# EAGLE design ALU (EAGLE 9.6.2)
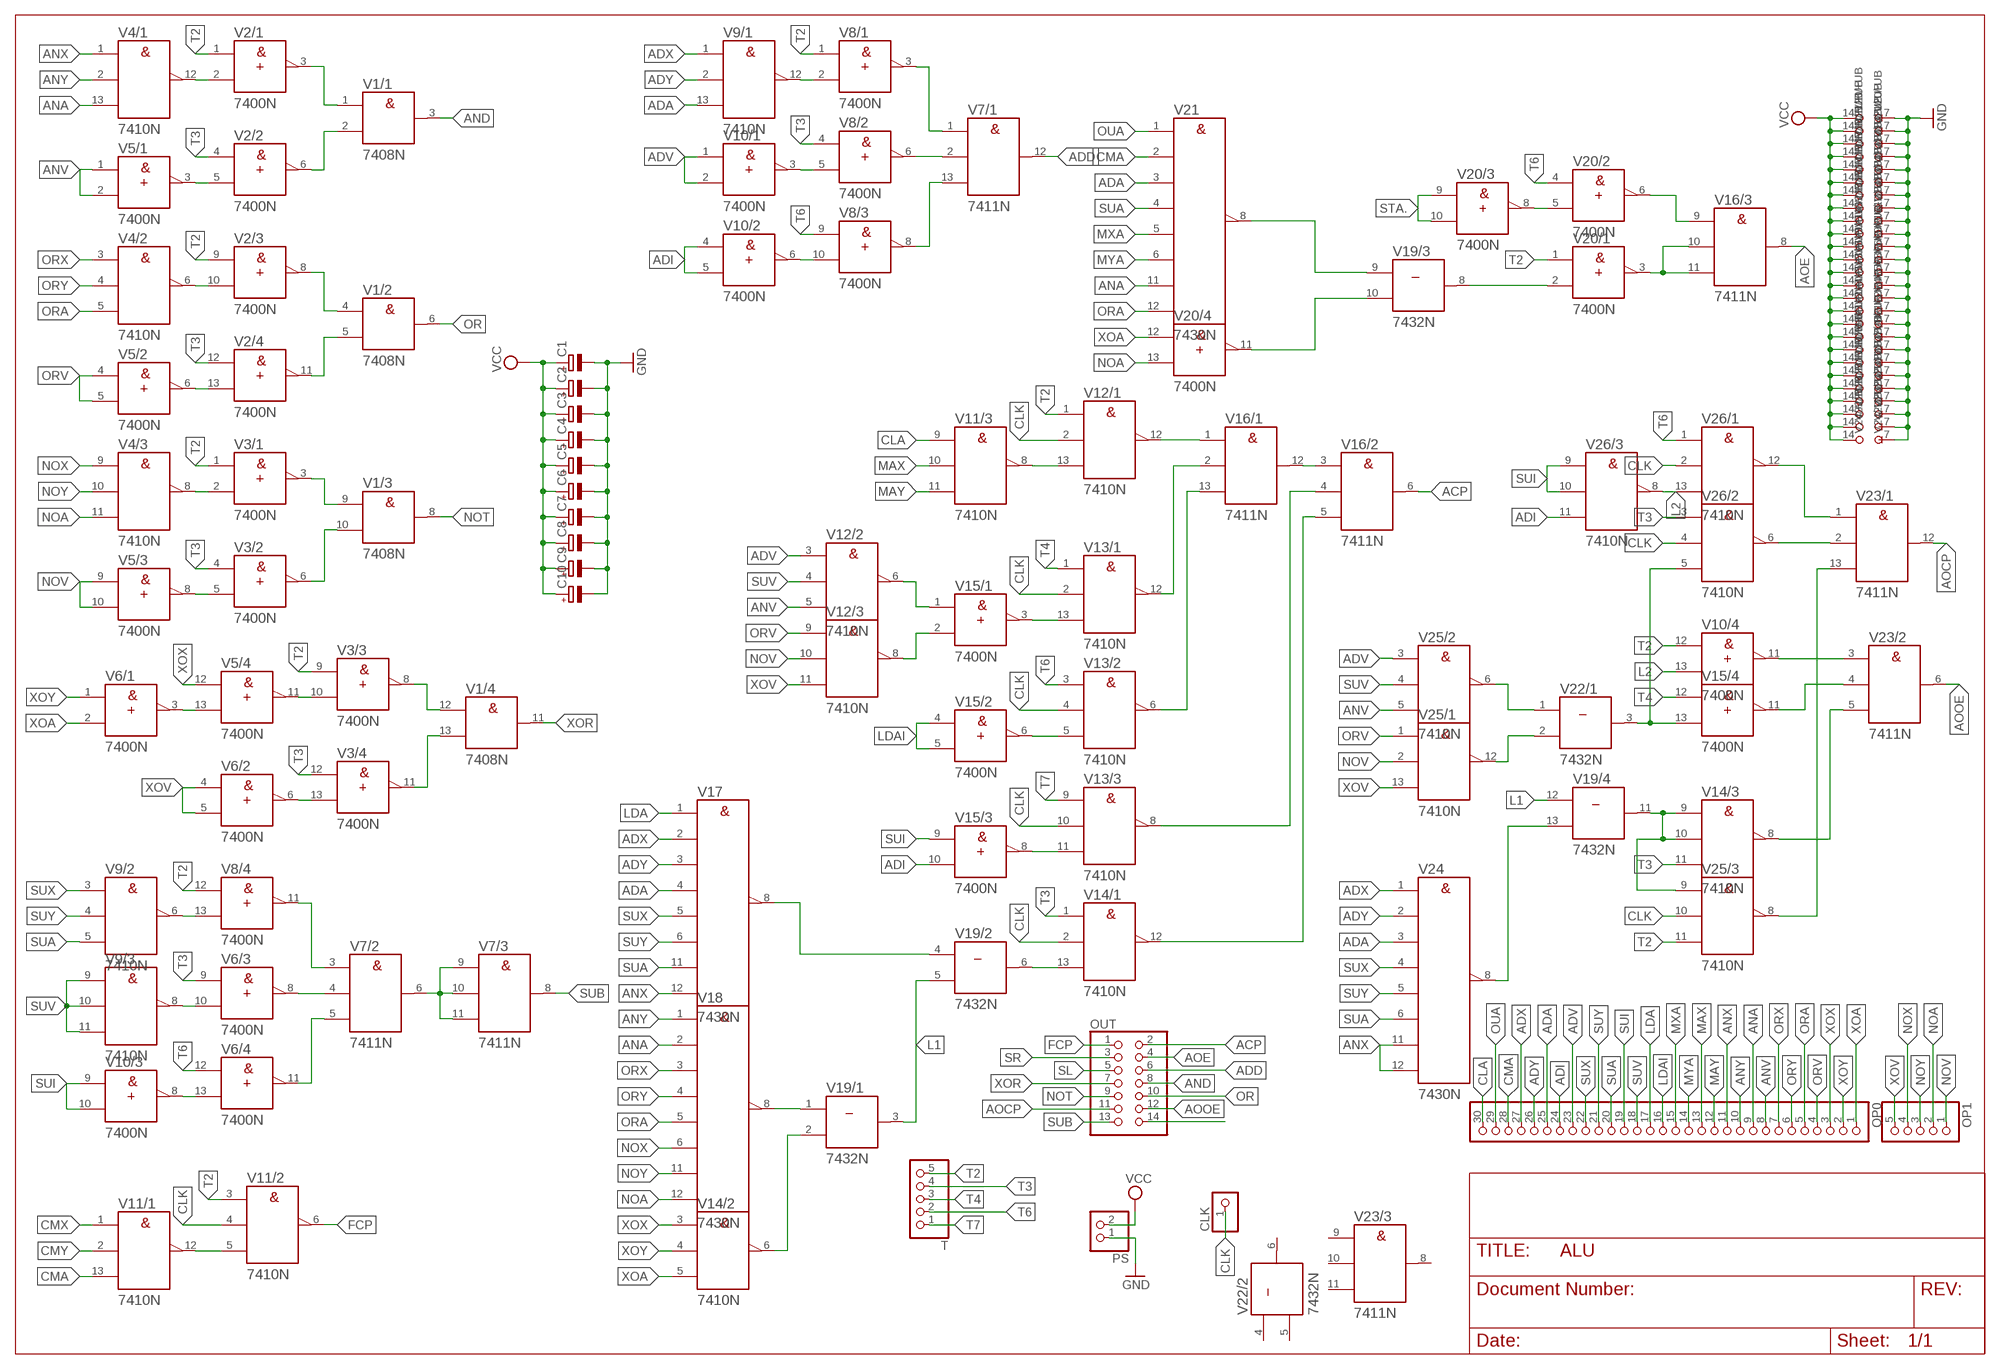
[diagram p0: schematic, sheet 1]

## Parts
C1  CPOL-EUE2.5-6  [E2,5-6]
C2  CPOL-EUE2.5-6  [E2,5-6]
C3  CPOL-EUE2.5-6  [E2,5-6]
C4  CPOL-EUE2.5-6  [E2,5-6]
C5  CPOL-EUE2.5-6  [E2,5-6]
C6  CPOL-EUE2.5-6  [E2,5-6]
C7  CPOL-EUE2.5-6  [E2,5-6]
C8  CPOL-EUE2.5-6  [E2,5-6]
C9  CPOL-EUE2.5-6  [E2,5-6]
C10  CPOL-EUE2.5-6  [E2,5-6]
CLK  PINHD-1X1  [1X01]
OP0  PINHD-1X30  [1X30]
OP1  PINHD-1X5  [1X05]
OUT  PINHD-2X7  [2X07]
PS  PINHD-1X2  [1X02]
T  PINHD-1X5  [1X05]
V1  7408N  [DIL14]
V2  7400N  [DIL14]
V3  7400N  [DIL14]
V4  7410N  [DIL14]
V5  7400N  [DIL14]
V6  7400N  [DIL14]
V7  7411N  [DIL14]
V8  7400N  [DIL14]
V9  7410N  [DIL14]
V10  7400N  [DIL14]
V11  7410N  [DIL14]
V12  7410N  [DIL14]
V13  7410N  [DIL14]
V14  7410N  [DIL14]
V15  7400N  [DIL14]
V16  7411N  [DIL14]
V17  7430N  [DIL14]
V18  7430N  [DIL14]
V19  7432N  [DIL14]
V20  7400N  [DIL14]
V21  7430N  [DIL14]
V22  7432N  [DIL14]
V23  7411N  [DIL14]
V24  7430N  [DIL14]
V25  7410N  [DIL14]
V26  7410N  [DIL14]

## Nets
ACP: OUT.2 V16.6(/2:Y)
ADA: OP0.25 V9.13(/1:C) V17.4(D) V21.3(C) V24.3(C)
ADD: OUT.6 V7.12(/1:Y)
ADI: OP0.24 V10.4(/2:A) V10.5(/2:B) V15.10(/3:B) V26.11(/3:C)
ADV: OP0.23 V10.1(/1:A) V10.2(/1:B) V12.3(/2:A) V25.3(/2:A)
ADX: OP0.27 V9.1(/1:A) V17.2(B) V24.1(A)
ADY: OP0.26 V9.2(/1:B) V17.3(C) V24.2(B)
ANA: OP0.9 V4.13(/1:C) V18.2(B) V21.11(G)
AND: OUT.8 V1.3(/1:Y)
ANV: OP0.8 V5.1(/1:A) V5.2(/1:B) V12.5(/2:C) V25.5(/2:C)
ANX: OP0.11 V4.1(/1:A) V17.12(H) V24.11(G) V24.12(H)
ANY: OP0.10 V4.2(/1:B) V18.1(A)
AOCP: OUT.11 V23.12(/1:Y)
AOE: OUT.4 V16.8(/3:Y)
AOOE: OUT.12 V23.6(/2:Y)
CLA: OP0.30 V11.9(/3:A)
CLK: CLK.1 V11.4(/2:B) V12.2(/1:B) V13.2(/1:B) V13.4(/2:B) V13.10(/3:B) V14.2(/1:B) V25.10(/3:B) V26.2(/1:B) V26.4(/2:B)
CMA: OP0.28 V11.13(/1:C) V21.2(B)
CMX: V11.1(/1:A)
CMY: V11.2(/1:B)
FCP: OUT.1 V11.6(/2:Y)
GND: C1.- C2.- C3.- C4.- C5.- C6.- C7.- C8.- C9.- C10.- PS.1 V1.7(/-UB:-UB) V2.7(/-UB:-UB) V3.7(/-UB:-UB) V4.7(/-UB:-UB) V5.7(/-UB:-UB) V6.7(/-UB:-UB) V7.7(/-UB:-UB) V8.7(/-UB:-UB) V9.7(/-UB:-UB) V10.7(/-UB:-UB) V11.7(/-UB:-UB) V12.7(/-UB:-UB) V13.7(/-UB:-UB) V14.7(/-UB:-UB) V15.7(/-UB:-UB) V16.7(/-UB:-UB) V17.7(-UB) V18.7(-UB) V19.7(/-UB:-UB) V20.7(/-UB:-UB) V21.7(-UB) V22.7(/-UB:-UB) V23.7(/-UB:-UB) V24.7(-UB) V25.7(/-UB:-UB) V26.7(/-UB:-UB)
L1: V19.3(/1:Y) V19.5(/2:B) V19.12(/4:A)
L2: V10.13(/4:B) V26.8(/3:Y) V26.13(/1:C)
LDA: OP0.17 V17.1(A)
LDAI: OP0.16 V15.4(/2:A) V15.5(/2:B)
MAX: OP0.13 V11.10(/3:B)
MAY: OP0.12 V11.11(/3:C)
MXA: OP0.15 V21.5(E)
MYA: OP0.14 V21.6(F)
N$1: V1.9(/3:A) V3.3(/1:Y)
N$2: V2.5(/2:B) V5.3(/1:Y)
N$3: V1.10(/3:B) V3.6(/2:Y)
N$4: V1.2(/1:B) V2.6(/2:Y)
N$5: V1.1(/1:A) V2.3(/1:Y)
N$6: V1.12(/4:A) V3.8(/3:Y)
N$7: V2.2(/1:B) V4.12(/1:Y)
N$8: V3.5(/2:B) V5.8(/3:Y)
N$9: V2.10(/3:B) V4.6(/2:Y)
N$10: V1.13(/4:B) V3.11(/4:Y)
N$11: V3.2(/1:B) V4.8(/3:Y)
N$12: V2.13(/4:B) V5.6(/2:Y)
N$13: OUT.14
N$14: V1.5(/2:B) V2.11(/4:Y)
N$15: V1.4(/2:A) V2.8(/3:Y)
N$16: V7.2(/1:B) V8.6(/2:Y)
N$17: V5.13(/4:B) V6.3(/1:Y)
N$18: V7.1(/1:A) V8.3(/1:Y)
N$19: V12.6(/2:Y) V15.1(/1:A)
N$20: V3.10(/3:B) V5.11(/4:Y)
N$21: V7.13(/1:C) V8.8(/3:Y)
N$22: V3.13(/4:B) V6.6(/2:Y)
N$23: V12.8(/3:Y) V15.2(/1:B)
N$24: V8.2(/1:B) V9.12(/1:Y)
N$25: V16.3(/2:A) V16.12(/1:Y)
N$26: V8.5(/2:B) V10.3(/1:Y)
N$27: V11.5(/2:C) V11.12(/1:Y)
N$28: V8.10(/3:B) V10.6(/2:Y)
N$29: V18.8(Y) V19.1(/1:A)
N$30: V8.13(/4:B) V9.6(/2:Y)
N$31: V16.10(/3:B) V16.11(/3:C) V20.3(/1:Y)
N$32: V6.10(/3:B) V9.8(/3:Y)
N$33: V14.6(/2:Y) V19.2(/1:B)
N$34: V6.13(/4:B) V10.8(/3:Y)
N$35: V6.8(/3:Y) V7.4(/2:B)
N$36: V7.3(/2:A) V8.11(/4:Y)
N$37: V6.11(/4:Y) V7.5(/2:C)
N$38: V7.6(/2:Y) V7.9(/3:A) V7.10(/3:B) V7.11(/3:C)
N$39: V17.8(Y) V19.4(/2:A)
N$40: V14.13(/1:C) V19.6(/2:Y)
N$41: V13.13(/1:C) V15.3(/1:Y)
N$42: V20.5(/2:B) V20.8(/3:Y)
N$43: V11.8(/3:Y) V12.13(/1:C)
N$44: V19.8(/3:Y) V20.2(/1:B)
N$45: V16.9(/3:A) V20.6(/2:Y)
N$46: V10.11(/4:Y) V23.3(/2:A)
N$47: V19.10(/3:B) V20.11(/4:Y)
N$48: V19.9(/3:A) V21.8(Y)
N$49: V12.12(/1:Y) V16.1(/1:A)
N$50: V13.12(/1:Y) V16.2(/1:B)
N$51: V13.6(/2:Y) V16.13(/1:C)
N$52: V13.8(/3:Y) V16.4(/2:B)
N$53: V14.12(/1:Y) V16.5(/2:C)
N$54: V15.11(/4:Y) V23.4(/2:B)
N$55: V13.5(/2:C) V15.6(/2:Y)
N$56: V13.11(/3:C) V15.8(/3:Y)
N$57: V14.8(/3:Y) V23.5(/2:C)
N$58: V23.2(/1:B) V26.6(/2:Y)
N$59: V23.1(/1:A) V26.12(/1:Y)
N$60: V14.9(/3:A) V14.10(/3:B) V19.11(/4:Y) V25.9(/3:A)
N$62: V15.13(/4:B) V22.3(/1:Y) V26.5(/2:C)
N$63: V23.13(/1:C) V25.8(/3:Y)
N$64: V19.13(/4:B) V24.8(Y)
N$69: V22.2(/1:B) V25.12(/1:Y)
N$70: V22.1(/1:A) V25.6(/2:Y)
NOA: OP1.2 V4.11(/3:C) V18.12(H) V20.13(/4:B)
NOT: OUT.9 V1.8(/3:Y)
NOV: OP1.1 V5.9(/3:A) V5.10(/3:B) V12.10(/3:B) V25.2(/1:B)
NOX: OP1.4 V4.9(/3:A) V18.6(F)
NOY: OP1.3 V4.10(/3:B) V18.11(G)
OR: OUT.10 V1.6(/2:Y)
ORA: OP0.5 V4.5(/2:C) V18.5(E) V21.12(H)
ORV: OP0.4 V5.4(/2:A) V5.5(/2:B) V12.9(/3:A) V25.1(/1:A)
ORX: OP0.7 V4.3(/2:A) V18.3(C)
ORY: OP0.6 V4.4(/2:B) V18.4(D)
OUA: OP0.29 V21.1(A)
SL: OUT.5
SR: OUT.3
STA.: V20.9(/3:A) V20.10(/3:B)
SUA: OP0.20 V9.5(/2:C) V17.11(G) V21.4(D) V24.6(F)
SUB: OUT.13 V7.8(/3:Y)
SUI: OP0.19 V10.9(/3:A) V10.10(/3:B) V15.9(/3:A) V26.9(/3:A) V26.10(/3:B)
SUV: OP0.18 V9.9(/3:A) V9.10(/3:B) V9.11(/3:C) V12.4(/2:B) V25.4(/2:B)
SUX: OP0.22 V9.3(/2:A) V17.5(E) V24.4(D)
SUY: OP0.21 V9.4(/2:B) V17.6(F) V24.5(E)
T2: T.5 V2.1(/1:A) V2.9(/3:A) V3.1(/1:A) V3.9(/3:A) V8.1(/1:A) V8.12(/4:A) V10.12(/4:A) V11.3(/2:A) V12.1(/1:A) V20.1(/1:A) V25.11(/3:C)
T3: T.4 V2.4(/2:A) V2.12(/4:A) V3.4(/2:A) V3.12(/4:A) V6.9(/3:A) V8.4(/2:A) V14.1(/1:A) V14.11(/3:C) V26.3(/2:A)
T4: T.3 V13.1(/1:A) V15.12(/4:A)
T6: T.2 V6.12(/4:A) V8.9(/3:A) V13.3(/2:A) V20.4(/2:A) V26.1(/1:A)
T7: T.1 V13.9(/3:A)
VCC: C1.+ C2.+ C3.+ C4.+ C5.+ C6.+ C7.+ C8.+ C9.+ C10.+ PS.2 V1.14(/+UB:+UB) V2.14(/+UB:+UB) V3.14(/+UB:+UB) V4.14(/+UB:+UB) V5.14(/+UB:+UB) V6.14(/+UB:+UB) V7.14(/+UB:+UB) V8.14(/+UB:+UB) V9.14(/+UB:+UB) V10.14(/+UB:+UB) V11.14(/+UB:+UB) V12.14(/+UB:+UB) V13.14(/+UB:+UB) V14.14(/+UB:+UB) V15.14(/+UB:+UB) V16.14(/+UB:+UB) V17.14(+UB) V18.14(+UB) V19.14(/+UB:+UB) V20.14(/+UB:+UB) V21.14(+UB) V22.14(/+UB:+UB) V23.14(/+UB:+UB) V24.14(+UB) V25.14(/+UB:+UB) V26.14(/+UB:+UB)
XOA: OP0.1 V6.2(/1:B) V14.5(/2:C) V20.12(/4:A)
XOR: OUT.7 V1.11(/4:Y)
XOV: OP1.5 V6.4(/2:A) V6.5(/2:B) V12.11(/3:C) V25.13(/1:C)
XOX: OP0.3 V5.12(/4:A) V14.3(/2:A)
XOY: OP0.2 V6.1(/1:A) V14.4(/2:B)
Unconnected: V22.4(/2:A) V22.5(/2:B) V22.6(/2:Y) V22.8(/3:Y) V22.9(/3:A) V22.10(/3:B) V22.11(/4:Y) V22.12(/4:A) V22.13(/4:B) V23.8(/3:Y) V23.9(/3:A) V23.10(/3:B) V23.11(/3:C)

## Library data of the parts
C1-C10 = rcl:CPOL-EU: POLARIZED CAPACITOR, European symbol; SPICEPREFIX: C
CLK = pinhead:PINHD-1X1: PIN HEADER
OP0 = pinhead:PINHD-1X30: PIN HEADER
OP1 T = pinhead:PINHD-1X5: PIN HEADER
OUT = pinhead:PINHD-2X7: PIN HEADER
PS = pinhead:PINHD-1X2: PIN HEADER
V1 = 74ttl-din:74*08: Quad 2-input AND gate
V2 V3 V5 V6 V8 V10 V15 V20 = 74ttl-din:74*00: Quad 2-input NAND gate
V4 V9 V11-V14 V25 V26 = 74ttl-din:74*10: Triple 3-input NAND gate
V7 V16 V23 = 74ttl-din:74*11: Triple 3-input AND gate
V17 V18 V21 V24 = 74ttl-din:74*30: 8-input NAND gate
V19 V22 = 74ttl-din:74*32: Quad 2-input OR gate

## Board
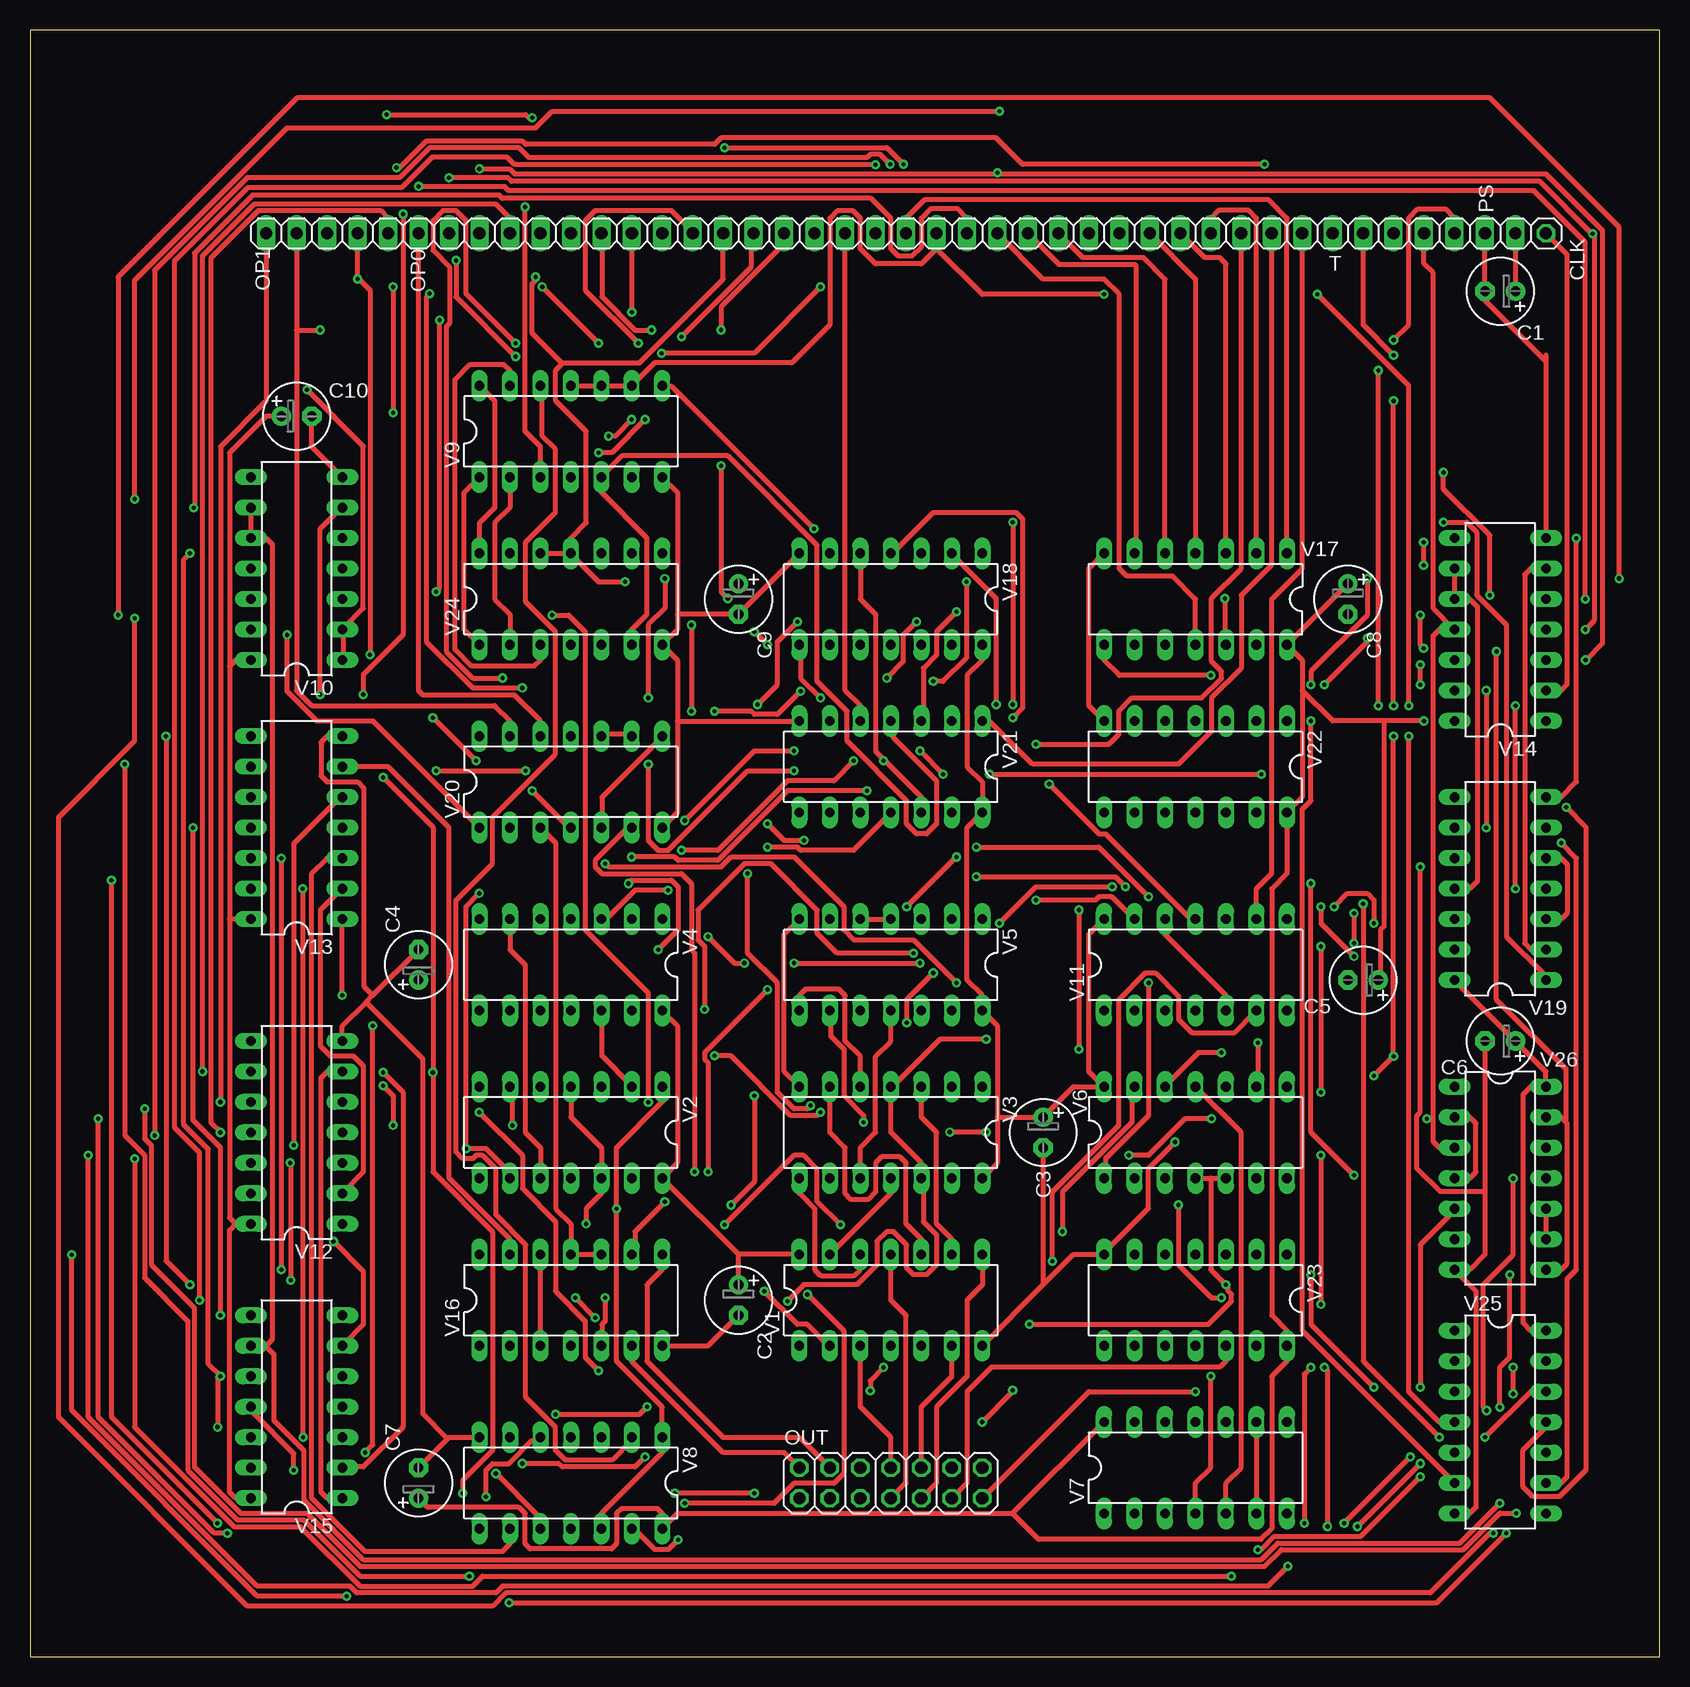
[diagram p1: board, top side]
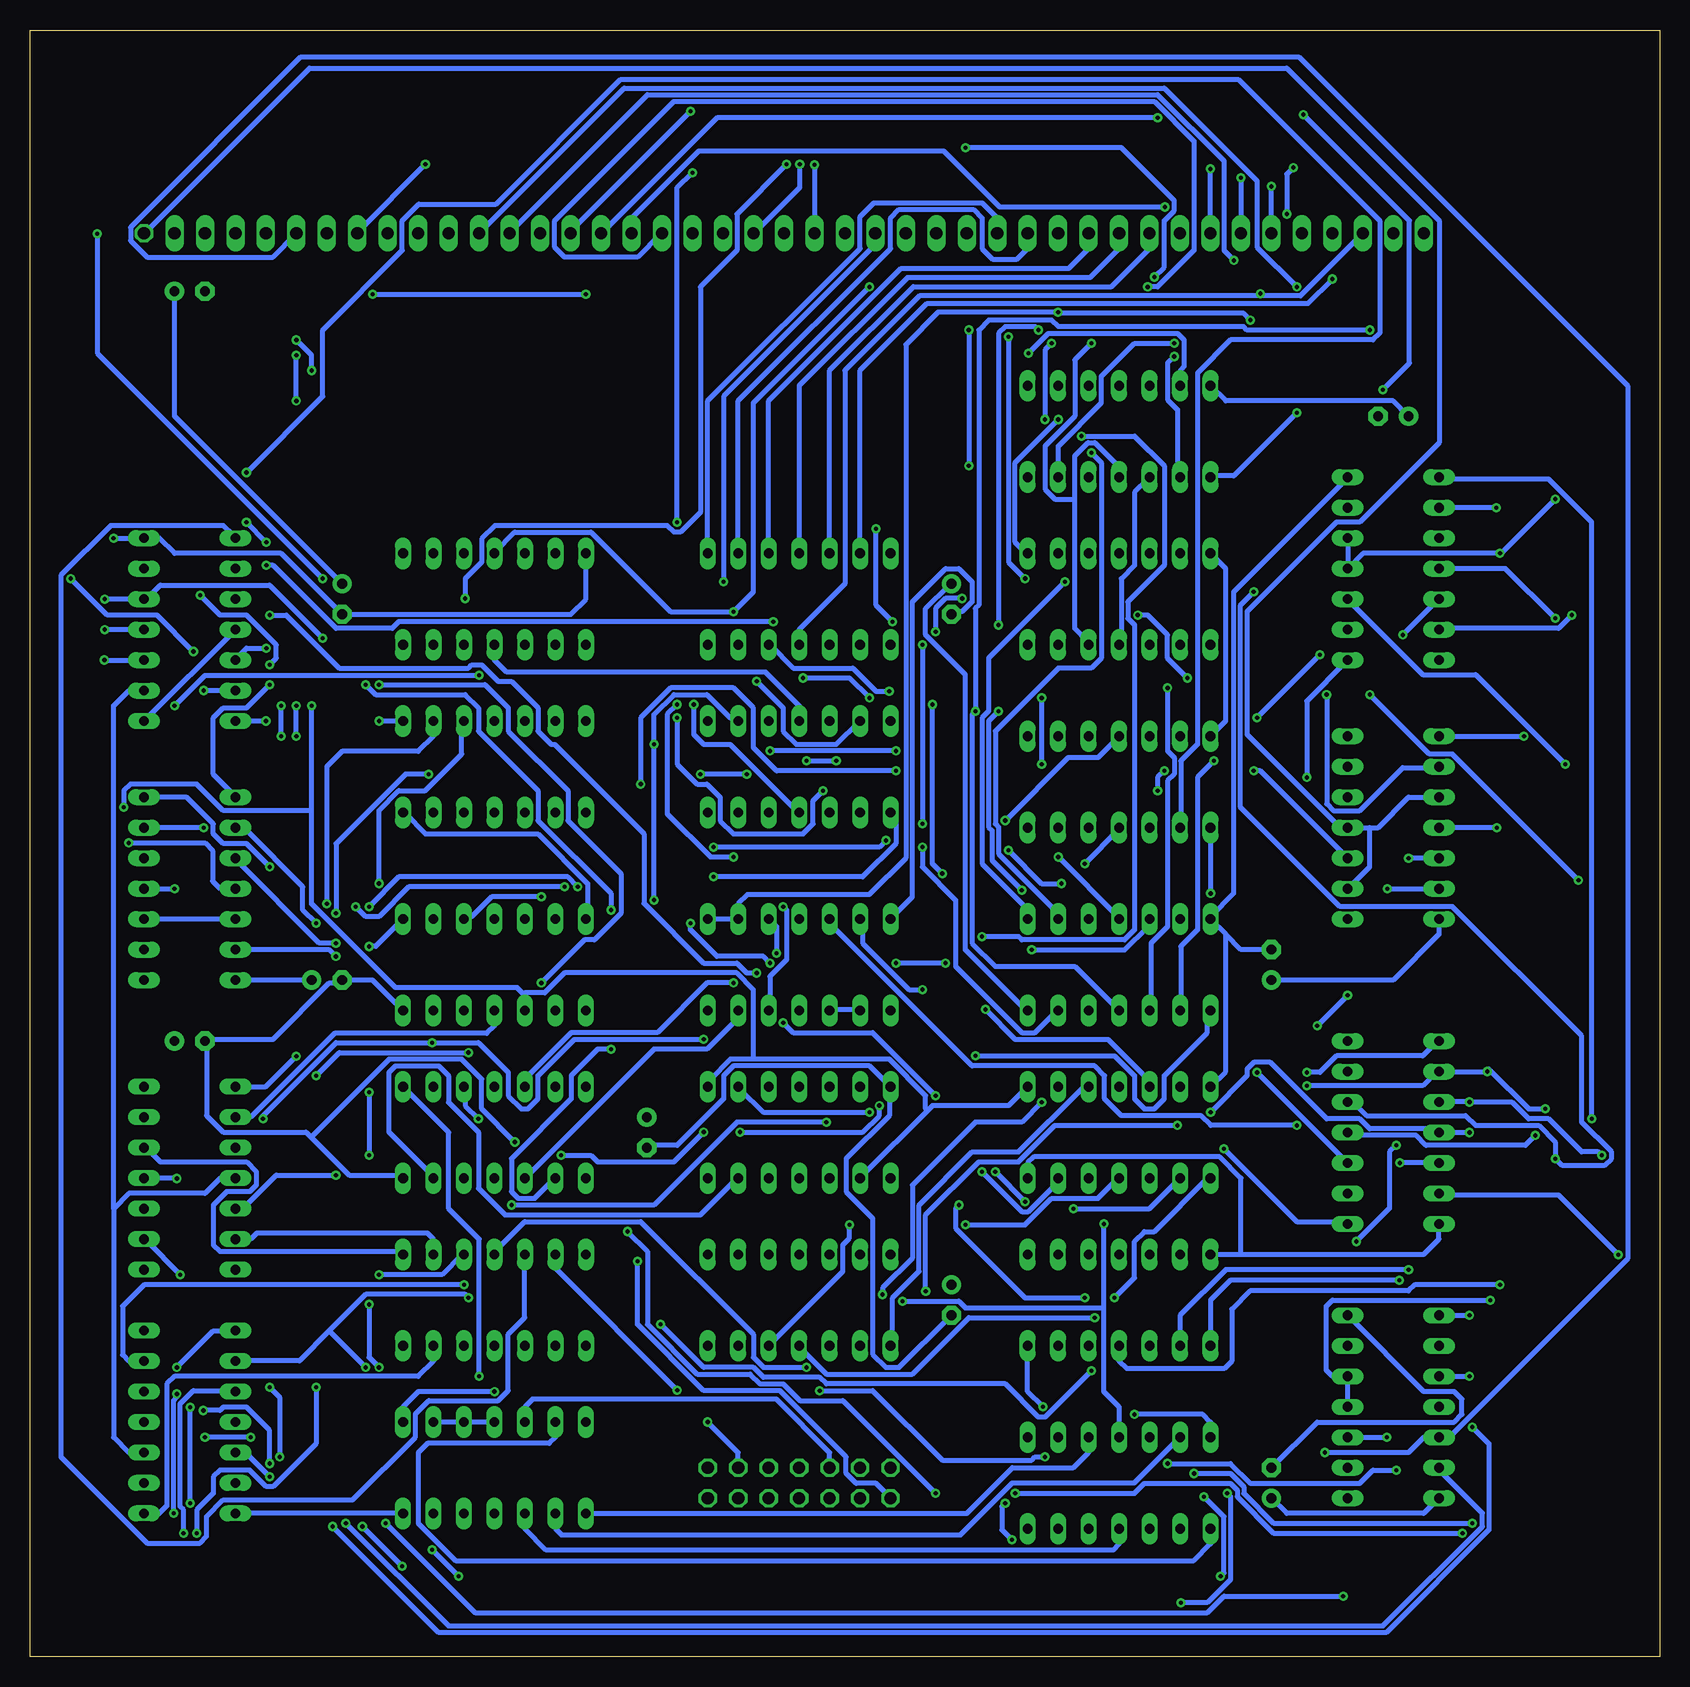
[diagram p2: board, bottom side, seen from below]

Size 135.87 x 135.56 mm. Coordinates in mm from the lower left corner, seen from the top.
Outline: 0,0 135.87,0 135.87,135.56 0,135.56 0,0
Copper layers (1*16): Top 0.035mm / dielectric 1.5mm / Bottom 0.035mm
Design rules "default *": minimum track width 0.4mm, minimum drill 0.35mm, track to track 6mil, track to pad 6mil, pad to pad 6mil, via to via 6mil, smd to smd 6mil, copper to edge 40mil, drill to drill 6mil, minimum pad ring 10mil, minimum via ring 8mil, stop-mask expansion 4mil, vias tented up to drill 0mil, thermal gap 10mil

### Footprints (pad centres in the part's own frame; a part is rotated, then mirrored left to right if it is on the bottom)
E2,5-6 = drill 0.813 pad 1.6: + -1.27,0 | drill 0.813 pad 1.6 octagon: - 1.27,0
1X01 = drill 1.016 octagon: 1 0,0
1X30 = drill 1.016 long: 1 -36.83,0; 2 -34.29,0; 3 -31.75,0; 4 -29.21,0; 5 -26.67,0; 6 -24.13,0; 7 -21.59,0; 8 -19.05,0; 9 -16.51,0; 10 -13.97,0; 11 -11.43,0; 12 -8.89,0; 13 -6.35,0; 14 -3.81,0; 15 -1.27,0; 16 1.27,0; 17 3.81,0; 18 6.35,0; 19 8.89,0; 20 11.43,0; 21 13.97,0; 22 16.51,0; 23 19.05,0; 24 21.59,0; 25 24.13,0; 26 26.67,0; 27 29.21,0; 28 31.75,0; 29 34.29,0; 30 36.83,0
1X05 = drill 1.016 long: 1 -5.08,0; 2 -2.54,0; 3 0,0; 4 2.54,0; 5 5.08,0
2X07 = drill 1.016 octagon: 1 -7.62,-1.27; 2 -7.62,1.27; 3 -5.08,-1.27; 4 -5.08,1.27; 5 -2.54,-1.27; 6 -2.54,1.27; 7 0,-1.27; 8 0,1.27; 9 2.54,-1.27; 10 2.54,1.27; 11 5.08,-1.27; 12 5.08,1.27; 13 7.62,-1.27; 14 7.62,1.27
1X02 = drill 1.016 long: 1 -1.27,0; 2 1.27,0
DIL14 = drill 0.813 long: 1 -7.62,-3.81; 2 -5.08,-3.81; 3 -2.54,-3.81; 4 0,-3.81; 5 2.54,-3.81; 6 5.08,-3.81; 7 7.62,-3.81; 8 7.62,3.81; 9 5.08,3.81; 10 2.54,3.81; 11 0,3.81; 12 -2.54,3.81; 13 -5.08,3.81; 14 -7.62,3.81

### Placement (x,y rotation side)
C1  122.56,113.79 180 top
C2  59.05,29.72 270 top
C3  84.45,43.69 270 top
C4  32.38,57.66 90 top
C5  111.12,56.39 180 top
C6  122.56,51.31 180 top
C7  32.38,14.48 90 top
C8  109.86,88.14 270 top
C9  59.05,88.14 270 top
C10  22.23,103.38 0 top
CLK  126.36,118.62 0 top
OP0  69.22,118.62 0 top
OP1  24.77,118.62 0 top
OUT  71.75,14.48 0 top
PS  122.56,118.62 0 top
T  113.67,118.62 0 top
V1  71.75,29.72 0 top
V2  45.09,43.69 180 top
V3  71.75,43.69 180 top
V4  45.09,57.66 180 top
V5  71.75,57.66 180 top
V6  97.16,43.69 0 top
V7  97.16,15.75 0 top
V8  45.09,14.48 180 top
V9  45.09,102.11 0 top
V10  22.23,90.68 90 top
V11  97.16,57.66 0 top
V12  22.23,43.69 90 top
V13  22.23,69.09 90 top
V14  122.56,85.6 90 top
V15  22.23,20.83 90 top
V16  45.09,29.72 0 top
V17  97.16,88.14 180 top
V18  71.75,88.14 180 top
V19  122.56,64.01 90 top
V20  45.09,72.9 0 top
V21  71.75,74.17 180 top
V22  97.16,74.17 180 top
V23  97.16,29.72 180 top
V24  45.09,88.14 0 top
V25  122.56,19.56 270 top
V26  122.56,39.88 270 top

### Tracks (layer width: path | path; a pad name or v marks a point on that pad's centre or on a via)
ACP
  Top 0.4: OUT.2 62.87,17.02 57.78,17.02 50.16,24.64 V16.6
ADA  (via drill 0.35)
  Top 0.4: V17.4 97.16,114.81 OP0.25 | V24.3 42.55,83.06 42.04,82.55 36.83,82.55 35.43,83.95 35.43,106.43 36.7,107.7 39.5,107.7 40.01,107.19 V9.13 | v77.22,87.08 75.57,85.42 75.57,83.49 74.46,82.39 74.46,78.24 V21.3 | v52.64,108.63 60.38,108.63 v65.9,114.15
  Bottom 0.4: V17.4 97.11,92.05 95.45,93.71 89.1,93.71 82.47,87.08 v77.22,87.08 75.57,88.74 75.57,104.48 v65.9,114.15 | v52.64,108.63 50.99,110.28 40.21,110.28 39.66,109.73 39.66,107.52 39.94,107.25 39.94,106.14 V9.13
ADD
  Bottom 0.4: OUT.6 69.22,17.02 73.66,21.46 93.98,21.46 94.61,20.83 V7.12
ADI  (via drill 0.35)
  Top 0.4: v13.34,91.95 12.83,91.44 12.83,44.32 14.86,42.29 14.86,24.38 v15.88,23.37 15.63,23.28 v15.63,19.14 | v123.63,39.85 123.63,33.5 121.14,31.01 121.14,20.8 v121.42,20.52 | v110.64,10.85 v115.89,16.1 | v80.82,128.79 43.53,128.79 42.15,127.41 21.43,127.41 8.73,114.7 v8.73,96.47
  Bottom 0.4: V15.10 v15.88,23.37 | V10.5 V10.4 24.77,91.95 v13.34,91.95 13.15,92.05 v8.73,96.47 | v123.63,39.85 126.11,39.85 V26.11 | v121.42,20.52 120.04,20.52 119.76,20.8 117.83,20.8 115.89,18.86 v115.89,16.1 | v110.64,10.85 101.81,2.01 22.81,2.01 14.25,10.57 14.25,17.76 v15.63,19.14 | v80.82,128.79 90.76,118.85 OP0.24
ADV  (via drill 0.35)
  Top 0.4: v29.44,73.27 33.59,69.13 v33.59,48.69 33.59,40.41 38.56,35.43 38.56,17.2 36.07,14.72 v36.07,13.61 | V10.1 26.13,83.22 26.13,85.42 V10.2 26.13,85.7 27.79,87.36 27.79,100.89 v23.09,105.59 | v123.07,10.3 117.27,4.5 v39.94,4.5 | v41.87,128.24 41.59,128.24 41.32,128.51 v29.72,128.51
  Bottom 0.4: v33.59,48.69 26.13,41.23 V12.3 | v29.44,73.27 29.44,79.62 26.13,82.94 V10.1 | v123.07,10.3 123.07,12.23 123.35,12.51 123.35,21.07 122.25,22.18 118.93,22.18 V25.3 | v39.94,4.5 37.73,4.5 35.8,6.43 35.8,13.34 v36.07,13.61 | v41.87,128.24 78.61,128.24 88,118.85 OP0.23 | v29.72,128.51 20.88,119.67 20.88,107.8 v23.09,105.59
ADX  (via drill 0.35)
  Top 0.4: OP0.27 98.42,119.89 99.06,120.52 101.6,120.52 102.23,119.89 V17.2 | V24.1 36.2,85.6 36.2,97.03 V9.1 | v30.27,114.15 v30.27,103.66
  Bottom 0.4: v30.27,103.66 35.52,98.41 37.45,98.41 V9.1 | v30.27,114.15 33.59,117.47 33.59,122.99 41.32,130.72 86.34,130.72 98.22,118.85 OP0.27
ADY  (via drill 0.35)
  Top 0.4: V9.2 40.01,95.76 38.73,94.49 38.73,88.14 40.01,86.87 V24.2 | OP0.26 97.92,116.59 99.19,116.59 99.69,116.08 V17.3 | v40.49,108.35 35.52,113.32 v35.52,116.36
  Bottom 0.4: v40.49,108.35 41.04,107.8 41.04,104.76 40.21,103.93 40.21,98.41 V9.2 | v35.52,116.36 36.35,117.19 36.35,124.65 41.87,130.17 84.41,130.17 95.73,118.85 OP0.26
ANA  (via drill 0.35)
  Top 0.4: v61.48,67.47 63.97,67.47 64.24,67.2 68.66,67.2 71.7,70.23 V21.11 | v80.54,79.35 80.54,88.19 76.95,91.78 V18.2
  Bottom 0.4: V18.2 76.83,104.65 64.14,117.35 64.14,119.89 63.42,120.61 57.23,120.61 56.52,119.89 56.52,117.35 55.63,116.46 53.59,116.46 52.7,117.35 OP0.9 | v61.48,67.47 61.48,65.81 58.72,63.05 58.72,57.53 53.2,52.01 52.09,52.01 50.43,53.66 V4.13 | v80.54,79.35 80.54,76.86 79.71,76.03 77.5,76.03 71.98,70.51 V21.11
AND
  Top 0.4: OUT.8 71.75,18.29 69.22,20.83 V1.3
ANV  (via drill 0.35)
  Top 0.4: OP0.8 v50.16,112.05 | v115.89,14.99 110.92,10.02 103.74,10.02 102.64,8.92 v102.36,8.92 | v100.15,6.71 37.73,6.71 36.9,5.88 27.51,5.88 22.54,10.85 17.01,10.85 8.73,19.14 v8.73,41.51 | v34.14,111.39 34.14,89.02 v33.86,88.74
  Bottom 0.4: V5.1 V5.2 76.83,62.74 76.07,63.5 65.91,63.5 62.87,66.55 62.87,109.35 60.17,112.05 v50.16,112.05 50.16,111.94 34.69,111.94 v34.14,111.39 | v115.89,14.99 117.83,16.93 118.66,16.93 V25.5 | v100.15,6.71 v102.36,8.92 | V12.5 25.85,46.48 24.47,45.1 16.18,45.1 15.36,44.27 10.11,44.27 8.73,42.89 v8.73,41.51 8.18,40.96 4.58,40.96 4.03,41.51 4.03,42.06 6.52,44.55 6.52,51.73 17.29,62.5 26.68,62.5 34.97,70.79 34.97,87.64 v33.86,88.74
ANX  (via drill 0.35)
  Top 0.4: V24.12 V24.11 | V24.11 45.09,93.22 46.35,94.49 46.35,102.11 43.81,104.65 43.81,107.19 44.45,107.82 | OP0.11 57.78,114.81 50.8,107.82 44.45,107.82 | v49.6,89.57 47.4,89.57 45.19,91.78 V24.11 | v99.6,88.19 99.6,84.6 V17.12 | v72.81,124.37 71.42,125.75 v57.89,125.75 | v42.15,114.98 42.15,114.7 41.87,114.43 41.87,110.28 44.36,107.8 44.45,107.82
  Bottom 0.4: v49.6,89.57 55.96,83.22 55.96,78.8 56.51,78.24 56.51,66.09 52.92,62.5 52.92,61.67 V4.1 | v99.6,88.19 99.6,89.84 98.22,91.23 98.22,93.16 97.11,94.26 82.75,94.26 82.2,93.71 81.64,93.71 79.99,95.37 79.99,114.15 76.95,117.19 76.95,120.23 v72.81,124.37 | v57.89,125.75 44.91,125.75 40.49,121.33 40.49,120.5 41.32,119.67 41.32,115.81 v42.15,114.98
ANY  (via drill 0.35)
  Top 0.4: v47.4,100.34 48.5,100.34 v51.26,103.1 | v50.71,109.45 46.29,113.87 46.29,119.67 47.12,120.5 53.47,120.5 55.13,118.85 OP0.10
  Bottom 0.4: OP0.10 55.24,119.89 56.52,121.16 65.53,121.16 66.67,120.02 66.67,117.35 79.38,104.65 V18.1 | v47.4,100.34 46.57,99.51 46.57,83.22 47.4,82.39 50.16,82.39 55.41,77.14 55.41,69.41 55.13,69.13 55.13,66.92 50.43,62.23 50.43,61.67 V4.2 | v51.26,103.1 51.26,108.9 v50.71,109.45
AOCP
  Top 0.4: V23.12 99.69,24.64 99.19,24.13 80.14,24.13 78.11,22.1 78.11,14.48 OUT.11
AOE
  Top 0.4: V16.8 52.7,32.26 51.44,30.99 51.44,24.64 57.78,18.29 64.14,18.29 OUT.4
AOOE  (via drill 0.35)
  Top 0.4: v79.38,19.56 81.92,22.1 v81.92,22.19
  Bottom 0.4: OUT.12 76.83,17.02 v79.38,19.56 | v81.92,22.19 92.08,32.35 V23.6
CLA
  Top 0.4: V11.9 102.23,64.01 103.5,65.28 103.5,88.14 106.05,90.68 OP0.30
CLK
  Top 0.4: V26.4 120.02,39.88 120.52,40.39 120.52,44.45 120.02,44.96 V26.2 | V14.2 127.64,80.52 128.14,81.03 128.14,116.84 CLK.1 | V12.2 26.13,38.75 27.79,40.41 27.79,49.24 26.96,50.07 25.02,50.07 24.2,50.9 24.2,62.23 25.85,63.88 V13.2
  Bottom 0.4: 24.2,69.09 V13.4 26.13,69.13 26.68,69.13 34.41,76.86 34.41,87.08 26.96,94.54 25.02,94.54 18.39,101.17 18.39,119.67 31.11,132.39 112.57,132.39 126.11,118.85 CLK.1 | 24.2,69.09 23.5,69.09 20.95,71.63 V13.10 | V25.10 127.64,17.02 128.91,18.29 128.91,37.34 | V26.4 120.02,39.88 121.28,38.61 127.64,38.61 128.91,37.34 | V14.2 127.64,80.52 128.91,79.25 128.91,37.34 | V11.4 97.16,52.58 97.79,51.94 110.49,51.94 117.47,44.96 V26.2 | 24.2,69.09 24.2,65.81 25.85,64.16 V13.2
CMA  (via drill 0.35)
  Top 0.4: v83.85,63.05 88.83,63.05 89.1,63.33 90.21,63.33 91.86,61.67 V11.13 | v83.85,76.03 89.93,76.03 90.76,76.86 90.76,78.8 91.86,79.9 97.66,79.9 99.32,81.56 99.32,82.11 98.49,82.94 98.49,88.19 100.98,90.67 100.98,118.57 OP0.28
  Bottom 0.4: v83.85,63.05 v83.85,76.03 83.85,78.52 82.2,80.18 79.44,80.18 77.5,78.24 76.95,78.24 V21.2
FCP  (via drill 0.35)
  Top 0.4: v85.23,32.95 85.23,38.75 90.76,44.27 90.76,54.77 92.97,56.98 93.8,56.98 95.73,55.04 95.73,53.11 96.83,52.01 100.43,52.01 102.08,53.66 V11.6
  Bottom 0.4: v85.23,32.95 85.23,27.7 79.71,22.18 73.36,22.18 67.83,16.65 67.83,15.27 67.01,14.44 65.35,14.44 64.24,13.34 OUT.1
GND  (via drill 0.35)
  Top 0.4: 126.36,108.46 126.36,107.95 | 126.36,107.95 V14.7 | V3.7 62.87,48.77 62.87,60.2 V5.7 | V9.7 53.98,97.03 53.98,86.87 | 53.98,86.87 53.98,85.6 V24.7 53.98,83.06 53.98,77.97 | 53.98,77.97 53.98,70.36 V20.7 | V22.7 88.27,79.25 88.27,90.68 V17.7 | V10.7 23.5,100.84 C10.- | V16.7 56.52,25.91 C2.- | V19.7 127.64,71.63 128.91,72.9 v128.91,93.22 | V12.7 26.04,52.58 28,54.55 | 28,54.55 28.57,55.12 | 28.57,55.12 C4.- | 53.98,86.87 C9.- V18.7 | V13.7 24.77,76.71 24.26,76.2 24.26,73.41 24.77,72.9 27.3,72.9 27.81,72.39 27.81,55.88 28.57,55.12 | V25.7 120.02,11.94 120.52,12.45 120.52,30.48 V26.7 120.02,32.26 121.28,33.53 121.28,38.75 | C6.- 121.28,38.75 | V1.7 84.45,30.99 | 84.45,30.99 87,33.53 V23.7 89.65,33.78 93.25,37.37 93.25,40.68 v95.45,42.89 | C3.- 84.45,30.99 | C7.- 34.82,18.18 | 34.82,18.18 34.92,18.29 V8.7 | v43.81,20.19 50.8,20.19 v51.44,20.83 | 28,54.55 32.76,49.8 32.76,20.24 34.82,18.18 | 53.98,77.97 63.97,77.97 V21.7 | v115.89,65.81 115.89,45.38 115.62,45.1 115.62,40.68 117.55,38.75 121.28,38.75 | 126.36,107.95 121.28,113.03 C1.- PS.1
  Bottom 0.4: C7.- 28.57,19.56 17.14,19.56 16.51,20.19 16.51,21.46 17.14,22.1 19.68,22.1 V15.7 | V7.7 V25.7 | C4.- 34.92,58.93 36.2,60.2 | 36.2,60.2 V4.7 37.45,61.67 35.52,63.61 35.52,88.74 26.13,98.13 V10.7 | V17.7 89.53,88.14 90.81,86.87 C8.- 114.94,91.95 123.83,91.95 125.09,93.22 V14.7 v128.91,93.22 | V2.7 36.2,48.77 36.2,60.2 | V11.7 107.31,56.39 C5.- 110.09,56.15 110.92,56.15 115.62,51.45 121.14,51.45 C6.- 121.14,51.18 121.14,45.1 119.76,43.72 112.86,43.72 112.44,43.3 | V8.7 37.47,19.56 38.1,20.19 v43.81,20.19 | v51.44,20.83 52.7,22.1 V16.7 | 112.44,43.3 109.26,40.13 104.84,40.13 V6.7 | C9.- 59,87.08 58.17,87.08 57.34,87.91 57.34,89.57 58.44,90.67 59.55,90.67 62.31,87.91 62.31,63.33 63.97,61.67 V5.7 | C3.- 84.41,42.61 81.92,42.61 78.05,46.48 78.05,48.41 77.22,49.24 65.9,49.24 64.24,47.59 V3.7 64.24,47.31 64.24,45.1 67.83,41.51 67.83,38.75 65.62,36.54 65.62,25.21 64.52,24.11 63.41,24.11 59.27,28.25 C2.- | 112.44,43.3 105.95,49.8 99.87,49.8 98.22,48.14 98.22,45.65 v95.45,42.89 | v115.89,65.81 117.83,67.75 119.76,67.75 120.59,68.58 120.59,69.41 122.8,71.61 126.11,71.61 V19.7
L1
  Top 0.4: V19.5 127.64,66.55 128.14,66.04 128.14,61.98 127.64,61.47 V19.3
  Bottom 0.4: V19.12 V19.3
L2  (via drill 0.35)
  Top 0.4: V26.8 127.64,32.26 128.14,32.77 128.14,44.45 127.91,44.69 | 127.91,44.69 127.64,44.96 V26.13 | v7.35,86.81 7.35,114.98 22.26,129.89 121.69,129.89 132.47,119.12 v132.47,89.84 | v122.25,83.77 122.25,54.77 128.05,48.97 128.05,44.82 127.91,44.69
  Bottom 0.4: v7.35,86.81 8.45,85.7 18.39,85.7 V10.13 | v132.47,89.84 129.43,86.81 125.28,86.81 v122.25,83.77
LDA
  Top 0.4: OP0.17 73.03,119.89 74.55,121.41 103.25,121.41 104.78,119.89 V17.1
LDAI  (via drill 0.35)
  Top 0.4: v14.13,29.72 14.13,42.01 12.06,44.07 12.06,116.33 18.16,122.43 30.99,122.43 33.53,124.97 39.77,124.97 40.41,124.33 v70.48,124.33
  Bottom 0.4: V15.4 V15.5 27.3,23.37 27.81,23.88 27.81,29.21 27.3,29.72 v14.13,29.72 | v70.48,124.33 OP0.16
MAX  (via drill 0.35)
  Top 0.4: v93.25,63.33 89.1,67.47 v78.88,67.47 | v64.52,68.03 62.86,68.03 v61.48,69.41 | v60.38,85.42 v61.48,84.32 | v58.17,88.19 57.62,88.74 v57.62,99.23 | v57.62,110.56 57.62,112.49 62.86,117.74 62.86,118.57 OP0.13
  Bottom 0.4: v93.25,63.33 97.39,63.33 99.05,61.67 99.6,61.67 V11.10 | v78.88,67.47 65.07,67.47 v64.52,68.03 | v61.48,84.32 v61.48,69.41 | v60.38,85.42 60.38,87.36 59.55,88.19 v58.17,88.19 | v57.62,110.56 v57.62,99.23
MAY  (via drill 0.35)
  Top 0.4: v84.96,72.72 89.1,68.58 89.65,68.58 96.56,61.67 97.11,61.67 V11.11 | v63.69,73.83 59.83,73.83 53.2,67.2 52.37,67.2 51.54,68.03 v51.54,74.38 | v51.54,79.9 51.54,85.98 52.92,87.36 v52.92,89.84 | v54.3,110.01 60.1,115.81 60.1,118.57 OP0.12
  Bottom 0.4: v84.96,72.72 84.96,78.24 82.47,80.73 77.22,80.73 75.57,79.07 75.57,75.76 73.64,73.83 v63.69,73.83 | v51.54,79.9 v51.54,74.38 | v52.92,89.84 54.3,91.23 v54.3,110.01
MXA
  Top 0.4: V21.5 69.22,79.25 67.94,80.52 OP0.15
MYA  (via drill 0.35)
  Top 0.4: v75.29,81.28 76.12,81.28 78.05,83.22 v78.05,89.57
  Bottom 0.4: v75.29,81.28 73.08,79.07 73.08,77.14 71.98,76.03 68.66,76.03 66.73,77.97 V21.6 | v78.05,89.57 78.05,105.04 65.62,117.47 65.62,118.57 OP0.14
N$1
  Top 0.4: V1.9 76.83,34.8 75.56,36.07 75.56,43.69 74.3,44.96 V3.3
N$2  (via drill 0.35)
  Top 0.4: v56.23,53.94 56.23,59.19 55.68,59.74 55.68,62.23 59.55,66.09 61.76,66.09 65.62,62.23 65.62,60.29 67.28,58.63 v73.64,58.63
  Bottom 0.4: v56.23,53.94 53.75,51.45 46.02,51.45 42.7,48.14 42.7,47.59 V2.5 | v73.64,58.63 73.64,60.84 74.19,61.4 V5.3
N$3
  Top 0.4: V1.10 74.3,34.8 73.03,36.07 73.03,41.15 72.52,41.66 70.99,41.66 70.48,41.15 70.48,38.73 69.85,38.1 68.45,38.1 67.94,38.61 67.94,42.42 66.67,43.69 V3.6
N$4  (via drill 0.35)
  Top 0.4: v40.21,44.27 40.21,47.31 V2.6 | v61.21,30.46 63.97,27.7 64.8,27.7 66.45,26.04 V1.2
  Bottom 0.4: v40.21,44.27 50.43,44.27 53.47,41.23 56.79,41.23 61.21,36.81 v61.21,30.46
N$5
  Bottom 0.4: V2.3 47.67,47.31 48.22,47.31 53.47,42.06 57.34,42.06 61.76,37.64 61.76,32.12 63.97,29.91 63.97,26.04 V1.1
N$6
  Top 0.4: V3.8 64.14,38.61 65.41,37.34 65.41,32.26 65.91,31.75 68.71,31.75 69.22,32.26 V1.12
N$7
  Top 0.4: V4.12 47.67,53.66 47.67,50.07 50.16,47.59 V2.2
N$8
  Top 0.4: V5.8 64.14,55.12 64.64,55.63 67.44,55.63 67.94,55.12 67.94,51.31 69.22,50.04 V3.5
N$9
  Top 0.4: V4.6 40.01,58.93 41.27,57.66 41.27,43.69 42.55,42.42 V2.10
N$10
  Top 0.4: V1.13 71.75,38.61 V3.11
N$11  (via drill 0.35)
  Top 0.4: v57.06,50.07 58.44,50.07 63.41,45.1 65.62,45.1 v65.9,45.38
  Bottom 0.4: v57.06,50.07 45.46,50.07 43.8,48.41 43.8,46.48 42.98,45.65 42.15,45.65 41.32,46.48 41.32,48.41 37.73,52.01 37.73,53.66 V4.8 | v65.9,45.38 74.74,45.38 76.67,47.31 V3.2
N$12  (via drill 0.35)
  Top 0.4: v56.51,40.41 56.51,49.52 56.23,49.8 56.23,50.35 v61.48,55.6
  Bottom 0.4: v56.51,40.41 53.2,37.09 52.64,37.09 50.43,39.3 50.43,39.85 V2.13 | v61.48,55.6 62.59,55.6 66.45,59.46 66.45,61.4 V5.6
N$14  (via drill 0.35)
  Top 0.4: v57.89,35.99 63.69,41.79 64.52,41.79 65.62,40.68 65.62,37.92 v67.56,35.99
  Bottom 0.4: v57.89,35.99 52.92,35.99 50.71,38.2 46.84,38.2 45.19,39.85 V2.11 | v67.56,35.99 67.56,34.88 68.11,34.33 68.11,32.12 74.19,26.04 V1.5
N$15  (via drill 0.35)
  Top 0.4: v47.12,28.25 v45.46,29.91
  Bottom 0.4: v45.46,29.91 43.8,31.57 43.8,34.6 42.98,35.43 42.15,35.43 37.73,39.85 V2.8 | v47.12,28.25 57.62,28.25 62.31,23.56 69.49,23.56 71.7,25.77 V1.4
N$16
  Bottom 0.4: V7.2 92.08,10.67 91.57,10.16 58.29,10.16 53.98,14.48 43.81,14.48 V8.6
N$17
  Bottom 0.4: V6.3 94.35,40.13 83.85,50.62 79.44,50.62 76.95,53.11 76.95,53.66 V5.13
N$18
  Bottom 0.4: V8.3 47.62,17.02 48.9,15.75 53.98,15.75 57.78,11.94 V7.1
N$19
  Top 0.4: V15.1 24.77,13.21 24.26,13.72 24.26,48.26 24.77,48.77 V12.6
N$20
  Top 0.4: V5.11 71.75,51.31 70.48,50.04 70.48,43.69 69.22,42.42 V3.10
N$21
  Bottom 0.4: V7.13 92.08,18.29 92.58,17.78 102.74,17.78 103.5,17.02 103.5,11.12 100.39,8 38.86,8 37.47,9.4 V8.8
N$22
  Bottom 0.4: V3.13 76.95,39.85 79.99,36.81 96.28,36.81 98.49,39.02 98.49,43.72 100.98,46.2 100.98,48.41 101.81,49.24 105.4,49.24 105.95,48.69 105.95,43.72 102.36,40.13 V6.6
N$23  (via drill 0.35)
  Top 0.4: v29.44,48.69 31.1,47.03 31.1,19.14 27.79,15.82 26.13,15.82 V15.2
  Bottom 0.4: v29.44,48.69 28.34,48.69 26.96,50.07 19.78,50.07 18.67,51.18 V12.8
N$24
  Top 0.4: V9.12 42.7,105.86 42.7,101.72 43.8,100.62 43.8,95.37 41.32,92.88 41.32,87.91 43.8,85.42 43.8,75.21 38.56,69.96 38.56,66.09 35.52,63.05 35.52,42.06 36.07,41.51 36.9,41.51 37.18,41.79 37.73,41.79 38.83,40.68 38.83,36.81 41.32,34.33 41.32,21.62 43.8,19.14 43.8,17.2 44.63,16.38 48.5,16.38 50.16,18.03 V8.2
N$25
  Top 0.4: V16.3 V16.12
N$26  (via drill 0.35)
  Top 0.4: v38.01,13.34 38.01,15.55 38.56,16.1 39.94,16.1 41.87,18.03 42.42,18.03 V8.5 | v36.62,6.71 27.51,6.71 22.81,11.4 17.29,11.4 13.15,15.55 13.15,27.98 9.56,31.57 9.56,41.79 7.9,43.44 v7.9,74.38
  Bottom 0.4: v38.01,13.34 36.35,11.68 36.35,6.99 v36.62,6.71 | v7.9,74.38 15.36,81.83 19.78,81.83 25.85,87.91 V10.3
N$27
  Top 0.4: V11.5 99.69,55.12 94.61,60.2 V11.12
N$28  (via drill 0.35)
  Top 0.4: v24.2,80.18 24.2,93.99 25.85,95.64 V10.6 | v6.79,64.71 6.79,19.97 v15.63,11.13 | v38.83,15.27 42.42,11.68 42.42,10.85 V8.10
  Bottom 0.4: v24.2,80.18 19.22,75.21 17.29,75.21 v6.79,64.71 | v15.63,11.13 32.2,11.13 34.69,13.61 34.69,14.17 35.8,15.27 v38.83,15.27
N$29  (via drill 0.35)
  Top 0.4: v117.83,94.54 119.76,94.54 120.59,93.71 120.59,88.46 123.07,85.98 123.07,60.02 126.11,56.98 126.11,56.42 V19.1 | v116.17,90.95 v116.17,92.88 | v73.91,86.25 72.81,85.15 72.81,82.94 v71.42,81.56 | v65.9,79.9 64.24,81.56 64.24,84.32 V18.8
  Bottom 0.4: v116.17,92.88 v117.83,94.54 | v116.17,90.95 115.62,90.95 110.37,85.7 105.67,85.7 105.12,86.25 v73.91,86.25 | v71.42,81.56 67.56,81.56 v65.9,79.9
N$30  (via drill 0.35)
  Top 0.4: v54.02,9.75 53.2,8.92 52.09,8.92 50.43,10.57 V8.13 | v54.58,12.79 62.03,12.79 63.69,14.44 67.01,14.44 67.83,15.27 67.83,27.15 v64.8,30.18 | v51.54,46.2 51.54,55.32 46.29,60.57 46.29,85.42 44.91,86.81 v43.53,86.81 | v39.39,81.56 36.9,81.56 34.69,83.77 34.69,110.84 34.97,111.11 34.97,115.81 33.59,117.19 33.59,119.67 34.41,120.5 35.52,120.5 36.35,119.67 36.35,113.6 v40.49,109.45
  Bottom 0.4: v54.02,9.75 54.85,10.57 54.85,12.51 v54.58,12.79 | v64.8,30.18 64.8,30.74 62.31,33.22 62.31,39.3 57.06,44.55 53.2,44.55 v51.54,46.2 | v43.53,86.81 42.7,86.81 41.04,85.15 41.04,83.22 v39.39,81.56 | v40.49,109.45 43.8,109.45 46.57,106.69 46.57,104.48 50.16,100.89 50.16,98.41 V9.6
N$31
  Top 0.4: V20.3 43.81,67.82 43.81,37.34 45.09,36.07 V16.11 V16.10
N$32  (via drill 0.35)
  Top 0.4: v65.35,93.99 53.47,105.86 52.92,105.86 V9.8 | v63.97,86.25 62.31,84.6 62.31,81.01 v60.65,79.35 | v59.83,65.26 59.83,58.63 62.31,56.15 62.31,47.03 63.69,45.65 64.8,45.65 v65.07,45.93 | v79.71,43.72 v76.67,43.72 | v91.59,41.79 93.25,41.79 96.28,44.82 v98.49,44.82
  Bottom 0.4: v65.35,93.99 65.35,87.64 v63.97,86.25 | v60.65,79.35 60.65,66.09 v59.83,65.26 | v65.07,45.93 65.07,45.1 66.45,43.72 v76.67,43.72 | v79.71,43.72 82.2,41.23 88.55,41.23 89.1,41.79 v91.59,41.79 | v98.49,44.82 99.6,45.93 99.6,47.31 V6.10
N$33
  Top 0.4: V14.6 125.09,90.68 124.59,90.17 124.59,59.44 125.09,58.93 V19.2
N$34  (via drill 0.35)
  Top 0.4: v5.69,44.82 5.69,19.97 15.36,10.3 v16.46,10.3 | v60.38,13.61 v53.75,13.61 | v86.06,35.43 86.06,38.75 91.86,44.55 91.86,47.31 V6.13
  Bottom 0.4: v5.69,44.82 5.69,94.54 9.28,98.13 18.39,98.13 V10.8 | v16.46,10.3 32.2,10.3 35.24,13.34 35.24,13.89 35.8,14.44 42.98,14.44 43.8,13.61 v53.75,13.61 | v60.38,13.61 68.11,21.35 71.7,21.35 73.08,22.73 75.02,22.73 75.84,23.56 80.26,23.56 84.41,27.7 84.41,33.78 v86.06,35.43
N$35  (via drill 0.35)
  Top 0.4: V7.4 97.16,14.48 98.42,15.75 v98.42,23.37
  Bottom 0.4: v98.42,23.37 98.42,34.8 100.97,37.34 100.97,43.69 V6.8
N$36
  Bottom 0.4: V8.11 45.09,9.4 45.59,8.89 92.84,8.89 94.61,10.67 V7.3
N$37
  Top 0.4: V7.5 99.69,14.48 100.97,15.75 100.97,43.69 V6.11
N$38
  Top 0.4: V7.9 V7.6
  Bottom 0.4: V7.11 V7.10 V7.9
N$39  (via drill 0.35)
  Top 0.4: v123.83,64.01 v123.83,79.25 | v98.42,81.79 90.81,81.79 89.53,83.06 V17.8
  Bottom 0.4: V19.4 v123.83,64.01 | v123.83,79.25 121.28,81.79 v98.42,81.79
N$40  (via drill 0.35)
  Top 0.4: v121.38,80.52 v121.38,69.09
  Bottom 0.4: V14.13 v121.38,80.52 | v121.38,69.09 V19.6
N$41  (via drill 0.35)
  Top 0.4: v22.76,18.29 22.76,63.98 v22.73,64.01
  Bottom 0.4: V15.3 v22.76,18.29 | v22.73,64.01 V13.13
N$42
  Top 0.4: V20.5 47.67,69.13 47.67,71.61 52.64,76.59 V20.8
N$43  (via drill 0.35)
  Top 0.4: v3.48,33.5 3.48,20.52 18.95,5.05 v26.4,5.05 | v106.23,11.13 106.23,23.56 v106.78,24.11 | v107.61,41.79 v107.61,29.36 | v107.61,59.19 v107.61,47.03
  Bottom 0.4: v3.48,33.5 8.45,38.47 18.39,38.47 V12.13 | v26.4,5.05 36.35,5.05 37.73,3.67 98.77,3.67 v106.23,11.13 | v106.78,24.11 107.61,24.94 v107.61,29.36 | v107.61,47.03 v107.61,41.79 | v107.61,59.19 107.06,59.19 104.84,61.4 V11.8
N$44  (via drill 0.35)
  Top 0.4: v117.83,98.68 117.83,97.3 121.69,93.44 v121.69,88.46 | v115.89,81.01 v115.89,82.66
  Bottom 0.4: v117.83,98.68 111.47,105.04 111.47,110.56 104.84,117.19 104.84,119.67 103.46,121.06 97.03,121.06 86.63,131.45 35.14,131.45 23.37,119.67 23.37,110.28 23.92,109.73 35.8,109.73 38.56,106.97 38.56,76.03 39.94,74.65 39.94,69.13 V20.2 | v121.69,88.46 120.04,86.81 117.83,86.81 115.34,84.32 115.34,83.22 v115.89,82.66 | v115.89,81.01 117.83,79.07 119.76,79.07 120.59,78.24 120.59,73.55 118.93,71.89 V19.8
N$45  (via drill 0.35)
  Top 0.4: v52.92,37.92 50.43,35.43 50.43,33.78 V16.9 | v55.41,40.41 55.41,58.63 55.13,58.91 55.13,64.43 54.3,65.26 47.67,65.26 47.12,65.81 47.12,66.37 49.6,68.85 50.16,68.85 V20.6
  Bottom 0.4: v55.41,40.41 v52.92,37.92
N$46  (via drill 0.35)
  Top 0.4: v8.73,86.53 8.73,76.31 2.38,69.96 2.38,19.97 18.12,4.22 38.56,4.22 39.66,5.33 116.72,5.33 121.69,10.3 v121.97,10.3 | v112.03,22.45 106.78,27.7 v106.78,31.84
  Bottom 0.4: v8.73,86.53 12.87,90.67 18.39,90.67 V10.11 | v121.97,10.3 121.97,12.23 120.59,13.61 120.59,14.99 120.04,15.55 117.55,15.55 116.17,14.17 115.62,14.17 112.03,17.76 v112.03,22.45 | v106.78,31.84 101.53,31.84 99.87,33.5 V23.3
N$47  (via drill 0.35)
  Top 0.4: v110.37,61.95 v110.37,59.46 | v79.99,73.55 v102.64,73.55 | v74.19,75.48 v76.12,73.55 | v63.69,75.48 60.38,75.48 v54.58,69.68
  Bottom 0.4: v110.37,59.46 111.75,59.46 118.66,66.37 V19.10 | v110.37,61.95 110.37,67.75 104.57,73.55 v102.64,73.55 | v76.12,73.55 v79.99,73.55 | v63.69,75.48 v74.19,75.48 | v54.58,69.68 49.33,74.93 46.84,74.93 45.19,76.59 V20.11
N$48  (via drill 0.35)
  Top 0.4: v112.03,61.12 112.03,63.05 111.47,63.61 109.82,63.61 v108.71,62.5 | v91.31,64.16 90.48,64.99 v78.88,64.99
  Bottom 0.4: v112.03,61.12 113.13,62.23 113.13,64.16 117.83,68.85 118.66,68.85 V19.9 | v108.71,62.5 107.88,61.67 106.78,61.67 104.29,64.16 v91.31,64.16 | v78.88,64.99 66.45,64.99 63.69,67.75 63.69,69.96 63.97,70.23 V21.8
N$49  (via drill 0.35)
  Top 0.4: v21.69,41.15 21.72,41.12 v21.72,31.37
  Bottom 0.4: V12.12 v21.69,41.15 | v21.72,31.37 35.81,31.37 37.47,29.72 V16.1
N$50  (via drill 0.35)
  Top 0.4: v20.95,66.55 v20.95,32.26
  Bottom 0.4: V13.12 v20.95,66.55 | v20.95,32.26 36.2,32.26 40.01,28.45 V16.2
N$51
  Top 0.4: V16.13 40.01,34.8 34.92,39.88 34.92,69.09 29.84,74.17 V13.6
N$52  (via drill 0.35)
  Top 0.4: v11.33,76.71 11.33,32.99 v13.34,30.99
  Bottom 0.4: V16.4 45.09,24.64 44.45,24 36.32,24 35.69,24.64 35.69,28.96 34.16,30.48 20.95,30.48 20.45,30.99 v13.34,30.99 | V13.8 v11.33,76.71
N$53  (via drill 0.35)
  Top 0.4: v47.95,29.91 47.95,27.98 47.67,27.7 47.67,26.04 V16.5 | v58.44,37.64 60.38,39.58 v60.38,46.76 | v73.08,52.83 73.08,54.77 v75.29,56.98 | v115.89,86.81 115.89,84.32 v116.17,84.04
  Bottom 0.4: v47.95,29.91 52.92,29.91 58.72,35.71 58.72,37.37 v58.44,37.64 | v60.38,46.76 65.62,52.01 72.25,52.01 v73.08,52.83 | v75.29,56.98 76.12,56.98 76.95,57.8 79.71,57.8 84.68,62.78 84.68,68.58 92.14,76.03 92.42,76.03 93.52,77.14 93.52,79.07 95.73,81.28 96.83,81.28 98.22,82.66 99.05,82.66 99.32,82.39 110.09,82.39 114.51,86.81 v115.89,86.81 | v116.17,84.04 117.83,84.04 118.66,83.22 V14.12
N$54  (via drill 0.35)
  Top 0.4: v21.98,15.55 21.98,16.93 18.67,20.24 18.67,20.8 V15.11 | v41.04,16.1 44.08,16.1 44.36,15.82 50.43,15.82 v51.26,16.65 | v70.04,22.18 70.04,23 v71.15,24.11
  Bottom 0.4: v21.98,15.55 23.92,15.55 25.02,14.44 34.14,14.44 35.8,16.1 v41.04,16.1 | v51.26,16.65 52.09,16.65 52.37,16.38 59.83,16.38 65.62,22.18 v70.04,22.18 | v71.15,24.11 74.74,24.11 75.57,24.94 75.57,26.87 84.96,36.26 94.63,36.26 97.11,33.78 V23.4
N$55  (via drill 0.35)
  Top 0.4: v25.3,34.6 27.79,32.12 27.79,27.7 26.13,26.04 V15.6 | v21.98,42.61 21.98,67.75 25.85,71.61 V13.5
  Bottom 0.4: v25.3,34.6 22.54,37.37 22.54,42.06 v21.98,42.61
N$56  (via drill 0.35)
  Top 0.4: v15.88,28.45 15.88,42.42 13.59,44.7 v13.59,69.09
  Bottom 0.4: V15.8 v15.88,28.45 | v13.59,69.09 V13.11
N$57
  Bottom 0.4: V23.5 94.63,33.5 94.63,28.25 96.01,26.87 96.01,22.18 96.83,21.35 102.64,21.35 103.74,20.24 103.74,18.31 108.99,13.06 119.76,13.06 121.14,11.68 121.14,10.02 121.69,9.47 126.11,9.47 133.29,16.65 133.29,90.12 129.15,94.26 119.76,94.26 118.93,93.44 V14.8
N$58
  Bottom 0.4: V23.2 102.23,34.8 102.74,35.31 116.97,35.31 117.47,34.8 V26.6
N$59
  Bottom 0.4: V23.1 104.84,33.78 120.04,33.78 120.59,34.33 120.59,37.64 119.48,38.75 117.55,38.75 117,39.3 117,40.41 117.83,41.23 125.01,41.23 126.11,42.34 V26.12
N$60  (via drill 0.35)
  Top 0.4: V14.9 V14.10 120.02,88.14 120.65,87.5 120.65,64.64 120.02,64.01 V19.11 | V25.9 127.64,14.48 128.14,14.99 128.14,31.5 128.91,32.26 128.91,66.55 v127.64,67.82
  Bottom 0.4: v127.64,67.82 121.28,67.82 120.65,67.18 120.65,64.64 120.02,64.01 V19.11
N$62  (via drill 0.35)
  Top 0.4: v115.06,16.65 v109.54,11.13 | v115.89,22.45 115.89,34.33 118.66,37.09 V26.5 | v106.78,64.43 106.78,43.72 v110.37,40.13
  Bottom 0.4: v109.54,11.13 100.98,2.56 23.09,2.56 14.8,10.85 14.8,11.96 18.39,15.55 V15.13 | v115.06,16.65 115.06,21.62 v115.89,22.45 | v106.78,64.43 106.78,70.51 105.12,72.17 102.91,72.17 99.87,75.21 99.87,77.97 V22.3 | v110.37,40.13 115.34,40.13 118.1,37.37 118.66,37.37 V26.5
N$63
  Bottom 0.4: V23.13 102.23,24.64 103.5,23.37 123.83,23.37 124.46,22.73 124.46,12.57 125.09,11.94 V25.8
N$64  (via drill 0.35)
  Top 0.4: v110.37,58.36 107.61,61.12 v107.61,62.5 | v90.21,64.16 83.85,64.16 v80.82,61.12 | v63.69,57.8 v74.19,57.8 | v59.55,57.8 58.72,57.8 v56.51,60.02 | v48.22,101.72 48.78,101.72 v50.16,103.1
  Bottom 0.4: v110.37,58.36 110.92,58.91 118.66,58.91 V19.13 | v107.61,62.5 105.12,64.99 91.03,64.99 v90.21,64.16 | v80.82,61.12 80.82,60.57 78.61,58.36 74.74,58.36 v74.19,57.8 | v59.55,57.8 v63.69,57.8 | v56.51,60.02 53.47,60.02 53.2,59.74 44.63,59.74 43.8,60.57 43.8,85.98 44.36,86.53 44.36,87.91 41.32,90.95 41.32,99.23 43.8,101.72 v48.22,101.72 | v50.16,103.1 53.75,99.51 53.75,92.88 52.92,92.05 V24.8
N$69  (via drill 0.35)
  Top 0.4: v121.28,18.29 125.09,22.1 V25.12 | v111.12,62.74 111.12,24.64 v117.47,18.29
  Bottom 0.4: V22.2 102.23,76.71 103.5,75.44 109.86,75.44 111.12,74.17 v111.12,62.74 | v117.47,18.29 v121.28,18.29
N$70  (via drill 0.35)
  Top 0.4: V25.6 106.05,27.18 106.05,70.61 106.78,71.34 v106.78,77.98
  Bottom 0.4: v106.78,77.98 V22.1
NOA  (via drill 0.35)
  Top 0.4: V20.13 40.01,77.98 38.73,79.25 23.5,79.25 22.23,80.52 22.23,110.56 | OP1.2 22.23,110.56 | v57.06,78.8 60.1,78.8 60.38,78.52 62.31,78.52 v64.24,80.45 | 22.23,110.56 v24.2,110.56
  Bottom 0.4: v64.24,80.45 65.35,80.45 67.28,82.39 72.25,82.39 74.19,84.32 V18.12 | V4.11 45.19,53.94 48.78,57.53 55.41,57.53 57.34,59.46 57.34,78.52 v57.06,78.8 57.06,87.36 56.79,87.64 56.79,110.56 55.96,111.39 50.71,111.39 50.16,110.84 34.69,110.84 34.41,110.56 v24.2,110.56
NOT
  Top 0.4: OUT.9 75.56,14.48 75.56,20.83 78.11,23.37 78.11,29.72 79.38,30.99 V1.8
NOV  (via drill 0.35)
  Top 0.4: OP1.1 19.68,104.65 15.88,100.84 v15.88,46.23 | v99.32,29.91 98.49,29.91 95.73,32.67 v95.73,37.64 | v69.49,44.55 69.49,45.1 67.83,46.76 67.83,50.62 66.73,51.73 66.73,53.66 V5.9 | v4.86,41.79 4.86,19.97 18.95,5.88 26.68,5.88 27.23,5.33 38.83,5.33 39.39,5.88 103.19,5.88 v104.84,7.54 | v108.16,10.85 108.16,23.83 v107.88,24.11
  Bottom 0.4: V12.10 v15.88,46.23 15.63,46.2 12.32,46.2 10.94,44.82 9.28,44.82 6.52,42.06 5.14,42.06 v4.86,41.79 | V5.9 66.73,53.94 68.94,53.94 V5.10 | 110.92,27.15 107.88,30.18 99.6,30.18 v99.32,29.91 | 110.92,27.15 113.41,24.66 118.66,24.66 V25.2 | v95.73,37.64 83.85,37.64 76.95,44.55 v69.49,44.55 | v108.16,10.85 v104.84,7.54 | 110.92,27.15 v107.88,24.11
NOX  (via drill 0.35)
  Top 0.4: OP1.4 v27.3,114.81 27.51,114.7 28.34,113.87 v28.34,83.49 | v33.59,78.24 v37.18,74.65
  Bottom 0.4: V18.6 66.67,107.19 61.09,112.78 29.34,112.78 v27.3,114.81 | v37.18,74.65 38.56,73.27 38.56,60.57 39.94,59.19 39.94,53.94 V4.9 | v28.34,83.49 v33.59,78.24
NOY  (via drill 0.35)
  Top 0.4: v41.04,80.73 36.9,80.73 33.03,84.6 33.03,113.32 v33.31,113.6
  Bottom 0.4: OP1.3 29.97,113.41 33.31,113.41 | V18.11 71.75,85.6 67.94,89.41 67.94,107.19 61.72,113.41 33.31,113.41 | v41.04,80.73 41.04,75.48 40.49,74.93 40.49,73.55 41.04,73 41.04,60.84 42.42,59.46 42.42,53.94 V4.10 | v33.31,113.6 33.31,113.41
OR
  Top 0.4: OUT.10 74.3,20.83 76.83,23.37 V1.6
ORA  (via drill 0.35)
  Top 0.4: V18.5 69.22,88.14 70.48,86.87 70.48,75.44 71.21,74.71 | V21.12 74.3,71.63 71.21,74.71 | v52.37,58.91 54.02,60.57 54.02,64.16 53.47,64.71 50.16,64.71 v49.88,64.43 | v54.3,67.2 57.34,67.2 63.14,73 67.01,73 v68.66,74.65 | v71.15,74.65 71.21,74.71
  Bottom 0.4: V18.5 69.22,107.19 62.23,114.17 45.72,114.17 42.55,117.35 OP0.5 | v52.37,58.91 44.63,58.91 42.7,60.84 42.7,61.4 V4.5 | v49.88,64.43 51.54,64.43 v54.3,67.2 | v71.15,74.65 v68.66,74.65
ORV  (via drill 0.35)
  Top 0.4: v14.38,48.77 14.38,116.74 18.71,121.08 38.82,121.08 40.01,119.89 OP0.4 | V5.5 69.22,61.4 71.7,61.4 V5.4 | v123.63,21.9 v123.63,24.11 | v123.9,11.96 122.52,11.96 119.48,8.92 104.29,8.92 102.91,7.54 27.51,7.54 23.09,11.96 17.57,11.96 13.7,15.82 13.7,29.08 10.11,32.67 10.11,42.61 9.56,43.17 v9.56,45.65 | v30.27,44.27 30.27,46.76 v29.44,47.59
  Bottom 0.4: v123.63,24.11 120.59,27.15 118.93,27.15 V25.1 | v123.63,21.9 123.63,21.62 123.9,21.35 v123.9,11.96 | v9.56,45.65 10.94,45.65 14.25,48.97 v14.38,48.77 V12.9 18.67,48.69 19.78,47.59 v29.44,47.59 | v30.27,44.27 37.45,44.27 38.28,45.1 44.91,45.1 46.29,46.48 46.29,48.41 47.12,49.24 57.34,49.24 68.94,60.84 68.94,61.4 V5.5
ORX  (via drill 0.35)
  Top 0.4: v53.2,63.88 50.43,63.88 48.22,61.67 47.67,61.67 V4.3 | v55.13,85.98 v55.13,78.8 | v51.81,110.56 50.43,110.56 47.67,113.32 47.67,118.57 OP0.7
  Bottom 0.4: V18.3 74.3,104.65 63.25,115.7 49.28,115.7 47.62,117.35 OP0.7 | v53.2,63.88 55.68,66.37 55.68,68.85 55.96,69.13 55.96,77.97 v55.13,78.8 | v55.13,85.98 55.13,110.28 54.58,110.84 52.09,110.84 v51.81,110.56
ORY  (via drill 0.35)
  Top 0.4: v50.16,66.64 53.75,66.64 54.02,66.37 57.34,66.37 63.14,72.17 v69.77,72.17 | v81.92,78.24 82.75,79.07 82.75,94.82 82.2,95.37 75.29,95.37 71.98,92.05 V18.4
  Bottom 0.4: OP0.6 45.09,117.35 47.5,114.94 62.74,114.94 71.75,105.92 V18.4 | v50.16,66.64 45.19,61.67 V4.4 | v69.77,72.17 70.6,71.34 70.6,69.41 71.42,68.58 77.22,68.58 78.33,69.68 78.33,71.61 79.44,72.72 80.26,72.72 81.92,74.38 v81.92,78.24
OUA
  Top 0.4: V21.1 79.44,77.97 79.99,77.97 83.58,74.38 95.73,74.38 98.49,77.14 98.49,79.9 100.98,82.39 100.98,88.46 103.46,90.95 103.46,118.57 OP0.29
STA.
  Top 0.4: V20.10 47.67,76.86 50.16,76.86 V20.9
SUA
  Top 0.4: V24.6 50.16,85.6 51.44,86.87 51.44,93.22 47.62,97.03 V9.5 47.67,98.41 49.33,100.06 58.17,100.06 65.62,92.61 65.62,81.28 68.11,78.8 68.11,76.31 73.08,71.34 73.08,69.41 73.91,68.58 74.74,68.58 75.57,69.41 75.57,73 71.98,76.59 71.98,77.97 V21.4 | OP0.20 84.45,114.81 89.53,114.81 90.81,113.54 90.81,90.68 91.44,90.04 95.25,90.04 97.16,88.14 V17.11
  Bottom 0.4: V21.4 71.75,79.25 74.55,82.04 96.14,82.04 97.16,83.06 V17.11
SUB  (via drill 0.35)
  Top 0.4: OUT.13 88.27,22.1 v97.16,22.1
  Bottom 0.4: v97.16,22.1 103.5,22.1 104.78,20.83 V7.8
SUI  (via drill 0.35)
  Top 0.4: V26.10 V26.9 | V10.9 V10.10 19.68,93.22 20.19,92.71 20.19,26.42 19.68,25.91 | 19.68,25.91 V15.9 | OP0.19 78.11,119.89 77.34,120.65 75.06,120.65 74.3,119.89 74.3,117.47 73.53,116.71 72.39,116.71 71.75,117.35 71.75,119.89 70.1,121.54 39.37,121.54 39.12,121.79 18.54,121.79 13.72,116.97 13.72,95.82 v13.65,95.76 | v123.35,31.84 123.35,24.94 122.52,24.11 v122.52,20.8 | v122.52,12.79 119.21,9.47 104.02,9.47 102.64,8.09 27.79,8.09 22.81,13.06 22.81,17.2 20.33,19.69 20.33,25.21 19.78,25.77 19.68,25.91
  Bottom 0.4: v13.65,95.76 V10.9 | v123.35,31.84 126.11,34.6 V26.9 | v122.52,12.79 v122.52,20.8
SUV  (via drill 0.35)
  Top 0.4: OP0.18 75.56,117.35 | 75.56,117.35 74.3,116.08 70.48,116.08 69.22,117.35 69.22,119.89 68.61,120.49 67.28,120.49 66.67,119.89 66.67,111 63.5,107.82 52.07,107.82 V9.9 V9.10 V9.11 | V25.4 117.47,19.56 114.94,22.1 v114.94,76.71 | v107.31,113.54 114.94,105.92 v114.94,79.25 | v89.53,113.54 79.38,113.54 75.56,117.35 | v10.38,43.44 10.38,115.53 18.12,123.27 30.82,123.27 33.31,125.75 40.77,125.75 41.59,124.92 69.77,124.92 70.04,125.2 70.87,125.2 v71.7,124.37
  Bottom 0.4: v114.94,76.71 v114.94,79.25 | v107.31,113.54 v89.53,113.54 | v10.38,43.44 11.21,42.61 19.5,42.61 20.33,43.44 25.85,43.44 V12.4 | v71.7,124.37 71.7,122.44 75.29,118.85 OP0.18
SUX  (via drill 0.35)
  Top 0.4: V17.5 94.61,114.81 92.84,116.59 87.76,116.59 OP0.22 | V9.3 42.55,100.84 41.27,102.11 v41.27,120.81
  Bottom 0.4: v41.27,120.81 55.02,120.81 59.69,125.48 80.14,125.48 85.72,119.89 OP0.22 | V24.4 44.91,84.6 44.91,89.84 43.8,90.95 43.8,97.03 42.7,98.13 V9.3
SUY  (via drill 0.35)
  Top 0.4: V17.6 92.2,92.08 92.2,115.91 92.08,116.03 85.77,116.03 OP0.21 | v42.7,114.15 v47.4,109.45
  Bottom 0.4: 48.78,96.47 48.78,85.7 47.67,84.6 V24.5 | 48.78,96.47 48.78,100.06 47.67,101.17 47.12,101.17 45.19,99.23 45.19,98.41 V9.4 | 48.78,96.47 50.43,96.47 51.26,97.3 51.26,100.89 48.78,103.38 48.78,108.07 v47.4,109.45 | v42.7,114.15 41.87,114.15 38.83,117.19 38.83,126.3 42.15,129.62 82.2,129.62 92.14,119.67 92.14,117.47 91.31,116.64 85.23,116.64 83.3,118.57 OP0.21
T2  (via drill 0.35)
  Top 0.4: V8.12 47.62,11.94 52.7,17.02 V8.1 52.7,20.83 48.9,24.64 v48.9,37.34 48.9,42.42 52.7,46.23 V2.1 | v112.39,79.25 v112.39,107.19 | v113.67,109.73 114.94,111 114.94,119.89 115.7,120.65 117.98,120.65 118.75,119.89 T.5 | v128.05,70.79 129.7,69.13 129.7,15.55 127.49,13.34 125.28,13.34 124.45,14.17 124.45,17.2 126.11,18.86 126.11,19.41 V25.11 | V2.9 40.21,40.13 38.01,42.34 v36.35,42.34 36.35,62.5 v37.45,63.61 | v21.43,85.15 21.43,80.45 23.92,77.97 28.61,77.97 37.45,69.13 V20.1
  Bottom 0.4: v48.9,37.34 42.55,37.34 V2.9 | V11.3 94.61,55.12 94.72,55.22 | 94.72,55.22 95.25,55.75 105.41,55.75 112.39,62.74 112.39,70.51 | v112.39,107.19 112.39,108.46 v113.67,109.73 | 112.39,70.51 v112.39,79.25 | v128.05,70.79 128.05,72.17 127.49,72.72 121.97,72.72 119.76,70.51 112.39,70.51 | v36.35,42.34 30.27,36.26 26.13,36.26 V12.1 | 61.07,45.51 60.65,45.93 54.3,45.93 52.92,47.31 V2.1 | 61.07,45.51 66.45,40.13 V3.9 | 75.57,49.8 64.24,49.8 61.21,46.76 61.21,45.65 61.07,45.51 | 75.57,49.8 77.5,49.8 79.16,48.14 79.16,47.59 V3.1 | v37.45,63.61 37.45,68.85 V20.1 | v21.43,85.15 18.67,87.91 V10.12 | 75.57,49.8 75.57,55.6 76.95,56.98 91.31,56.98 92.97,55.32 94.63,55.32 94.72,55.22
T3  (via drill 0.35)
  Top 0.4: V26.3 117.47,42.42 116.97,42.93 116.97,44.82 | 116.97,44.82 116.97,85.09 117.47,85.6 V14.11 116.97,87.38 116.97,115.32 116.2,116.08 T.4 | v46.35,36.07 46.35,37.34 47.62,38.61 V2.12 47.62,42.42 45.09,44.96 V2.4 | v102.36,51.18 102.36,47.59 V6.9 | 116.97,44.82 v116.45,44.82 | v79.71,51.45 75.84,51.45 71.98,47.59 V3.4 71.75,43.69 74.3,41.15 V3.12 74.46,39.85 74.46,36.26 75.57,35.16 75.57,32.67 74.74,31.84 73.64,31.84 73.08,32.4 73.08,34.33 71.98,35.43 71.42,35.43 70.6,34.6 70.6,32.67 68.94,31.01 64.52,31.01 v63.14,29.63
  Bottom 0.4: V14.1 V14.11 | V8.4 45.09,20.83 46.35,22.1 46.35,29.08 | v116.45,44.82 116.45,45.1 110.37,51.18 v102.36,51.18 98.49,51.18 96.01,48.69 96.01,46.76 94.9,45.65 94.35,45.65 93.52,46.48 93.52,48.41 90.48,51.45 v79.71,51.45 | v63.14,29.63 58.44,29.63 57.89,29.08 46.36,29.08 46.35,29.08 | 46.35,29.08 v46.35,36.07
T4  (via drill 0.35)
  Top 0.4: v27.94,17.02 28.57,17.65 v28.57,52.58 | v26.04,55.12 V13.1
  Bottom 0.4: v28.57,52.58 v26.04,55.12 | v27.94,17.02 20.95,17.02 19.68,18.29 V15.12 18.39,18.31 17.57,18.31 2.65,33.22 2.65,105.86 30.07,133.29 113.33,133.29 127.49,119.12 127.49,118.02 126.11,116.64 115.62,116.64 113.68,118.57 T.3
T6  (via drill 0.35)
  Top 0.4: V8.9 40.01,9.4 39.37,8.76 27.94,8.76 23.5,13.21 23.5,65.28 24.77,66.55 V13.3 | v113.67,79.25 v113.67,104.65 | v113.67,108.46 111.12,111 T.2 | v113.67,76.71 v113.67,50.04 113.41,49.8 v112.03,48.41 | v99.32,50.35 97.39,50.35 94.63,47.59 V6.12 | v41.87,72.17 44.91,69.13 V20.4 | v33.86,73.83 v41.32,73.83 | v77.22,56.15 73.64,59.74 68.66,59.74 67.83,60.57 67.83,62.5 63.69,66.64 58.44,66.64 57.62,65.81 48.22,65.81 v47.95,66.09
  Bottom 0.4: V26.1 116.2,47.5 v113.67,50.04 | v113.67,76.71 v113.67,79.25 | v113.67,104.65 v113.67,108.46 | v99.32,50.35 110.09,50.35 v112.03,48.41 | v41.87,72.17 41.87,73.27 v41.32,73.83 | v33.86,73.83 33.31,73.83 26.13,66.64 V13.3 | v77.22,56.15 79.44,56.15 83.58,52.01 90.76,52.01 94.35,48.41 94.35,47.59 V6.12 | v47.95,66.09 45.19,68.85 V20.4
T7  (via drill 0.35)
  Top 0.4: v27.79,80.18 27.79,81.83 31.1,85.15 v31.1,120.23 | v30.55,124.09 30.82,124.09 33.03,126.3 41.04,126.3 41.32,126.03 57.06,126.03 57.62,126.58 80.54,126.58 82.75,124.37 v102.91,124.37
  Bottom 0.4: v27.79,80.18 27.79,71.06 27.23,70.51 25.02,70.51 21.43,74.1 18.67,74.1 V13.9 | v31.1,120.23 31.1,123.54 v30.55,124.09 | v102.91,124.37 108.44,118.85 T.1
VCC  (via drill 0.35)
  Top 0.4: V25.14 125.09,27.18 124.46,27.81 124.46,46.86 125.09,47.5 V26.14 126.36,48.77 C6.+ 123.63,51.45 118.93,56.15 V19.14 | V15.14 17.14,13.21 16.64,13.72 16.64,35.56 17.14,36.07 | C7.+ 33.15,12.45 40.77,12.45 41.27,11.94 41.27,9.4 41.68,8.99 48.49,8.99 48.9,9.4 48.9,11.94 49.3,12.34 52.3,12.34 52.7,11.94 V8.14 53.98,11.94 81.92,11.94 | V12.14 17.14,36.07 | V10.14 17.14,83.06 16.64,82.55 | 17.14,36.07 16.64,36.58 16.64,61.47 | 16.64,82.55 16.64,61.47 | V13.14 16.64,61.47 | C10.+ 19.68,103.38 16.64,100.33 16.64,82.55 | V9.14 38.73,104.65 38.73,95.76 37.47,94.49 V24.14 | 106.05,80.52 106.05,83.06 V17.14 C8.+ | 106.05,80.52 106.05,71.63 V22.14 104.78,65.28 103.5,64.01 103.5,28.45 104.78,27.18 V23.14 104.78,24.64 103.5,23.37 103.5,10.67 102.62,9.78 84.07,9.78 81.92,11.94 | V4.14 53.98,52.58 53.98,41.15 V2.14 59.05,33.53 | V1.14 59.05,33.53 | C2.+ 59.05,33.53 | v116.2,77.98 112.86,77.98 | 112.86,77.98 108.58,77.98 106.05,80.52 | 81.92,11.94 V7.14 | 80.64,44.96 80.64,52.58 V5.14 79.38,55.12 78.11,56.39 78.11,69.09 V21.14 79.38,72.9 78.11,74.17 78.11,81.79 79.38,83.06 V18.14 | 80.64,44.96 80.64,41.15 V3.14 | V11.14 88.27,60.2 88.27,48.77 V6.14 87,47.5 C3.+ 80.64,44.96 | 112.86,77.98 112.86,60.84 112.58,60.57 112.58,56.42 C5.+ | PS.2 C1.+
  Bottom 0.4: V15.14 19.68,11.94 31.11,11.94 C7.+ | C8.+ 123.83,103.38 C1.+ | V16.14 34.92,33.53 | 34.92,33.53 19.68,33.53 18.41,34.8 V12.14 | C10.+ 22.23,104.65 36.2,104.65 V9.14 | C5.+ V19.14 | V14.14 v116.2,77.98 | V13.14 18.41,60.2 22.23,56.39 C4.+ | V20.14 36.2,77.98 36.2,90.68 V24.14 | 34.92,33.53 34.92,39.88 36.7,41.66 52.2,41.66 52.7,41.15 V2.14 | C9.+ 59.27,89.29 61.21,87.36 61.21,85.15 57.89,81.83 57.89,58.91 52.92,53.94 V4.14 | V11.14 89.38,61.67 89.38,64.43 93.52,68.58 102.91,68.58 104.57,70.23 V22.14
XOA  (via drill 0.35)
  Top 0.4: v129.64,88.14 129.64,117.89 125.35,122.17 39.88,122.17 39.53,122.52 v32.38,122.52 | V20.12 42.55,77.98 40.39,80.14 32.77,80.14 32.38,80.52 OP0.1 | v87.44,62.23 v87.44,50.62 | v107.88,81.01 111.47,84.6 v111.47,84.87
  Bottom 0.4: v129.64,88.14 V14.5 126.11,88.19 125.01,89.29 115.89,89.29 v111.47,84.87 | OP0.1 v32.38,122.52 | v87.44,50.62 88.55,50.62 90.76,48.41 90.76,46.48 95.73,41.51 95.73,38.75 95.18,38.2 93.8,38.2 92.14,39.85 V6.2 | v87.44,62.23 87.44,63.61 93.52,69.68 93.52,72.17 98.49,77.14 98.49,79.07 99.6,80.18 107.06,80.18 v107.88,81.01
XOR
  Top 0.4: OUT.7 73.03,14.48 73.03,28.45 71.75,29.72 V1.11
XOV  (via drill 0.35)
  Top 0.4: v15.88,43.69 15.11,44.45 15.11,116.59 19.05,120.52 29.21,120.52 29.84,119.89 OP1.5 | V6.4 98.42,39.88 | 98.42,39.88 V6.5 | 98.42,39.88 98.42,32.26 v99.69,30.99 99.87,30.74 99.87,30.46 100.15,30.18 100.15,29.63 98.22,27.7 v83.3,27.7 | v47.4,23.83 46.29,24.94 46.29,27.98 43.8,30.46 43.8,36.26 41.04,39.02 41.04,41.79 v37.45,45.38
  Bottom 0.4: v15.88,43.69 V12.11 18.67,43.72 18.95,43.99 24.2,43.99 25.02,44.82 27.79,44.82 32.48,49.52 33.86,49.52 34.41,48.97 34.41,48.41 v37.45,45.38 | v99.69,30.99 126.36,30.99 128.14,29.21 128.14,25.15 127.64,24.64 V25.13 | v83.3,27.7 79.71,24.11 75.57,24.11 74.74,23.28 70.04,23.28 69.49,22.73 54.58,22.73 51.81,19.97 51.26,19.97 v47.4,23.83
XOX  (via drill 0.35)
  Top 0.4: v129.67,83.06 131.06,84.45 131.06,118.87 126.36,123.57 80.64,123.57 | v77.22,66.64 v73.08,62.5 | v81.92,94.54 v81.92,79.35 | v37.47,123.98 39.97,123.98 40.39,123.57 80.64,123.57 | v80.64,123.67 80.64,123.57
  Bottom 0.4: v129.67,83.06 V14.3 | OP0.3 v37.47,123.98 | v73.08,62.5 72.81,62.23 72.81,58.08 74.19,56.7 74.19,53.94 V5.12 | v77.22,66.64 79.16,66.64 82.75,70.23 82.75,78.52 v81.92,79.35 | v81.92,94.54 81.92,122.44 80.69,123.67 v80.64,123.67
XOY  (via drill 0.35)
  Top 0.4: v129.64,85.6 130.43,86.39 130.43,118.36 130.24,118.55 | v34.92,123.25 39.81,123.25 40.13,122.94 125.86,122.94 130.24,118.55 | v93.25,56.15 93.25,45.1 89.65,41.51 89.65,40.13 V6.1 | v106.78,81.01 106.78,82.11 111.47,86.81 v111.47,89.84 | v130.26,118.57 130.24,118.55
  Bottom 0.4: V14.4 v129.64,85.6 | v34.92,123.25 OP0.2 | v93.25,56.15 89.65,59.74 88.83,59.74 86.62,61.95 86.62,65.26 91.03,69.68 91.03,72.17 96.01,77.14 96.01,79.07 97.94,81.01 v106.78,81.01 | v111.47,89.84 130.26,108.63 v130.26,118.57